# Altium project Pi Control Board V0.PrjPcb
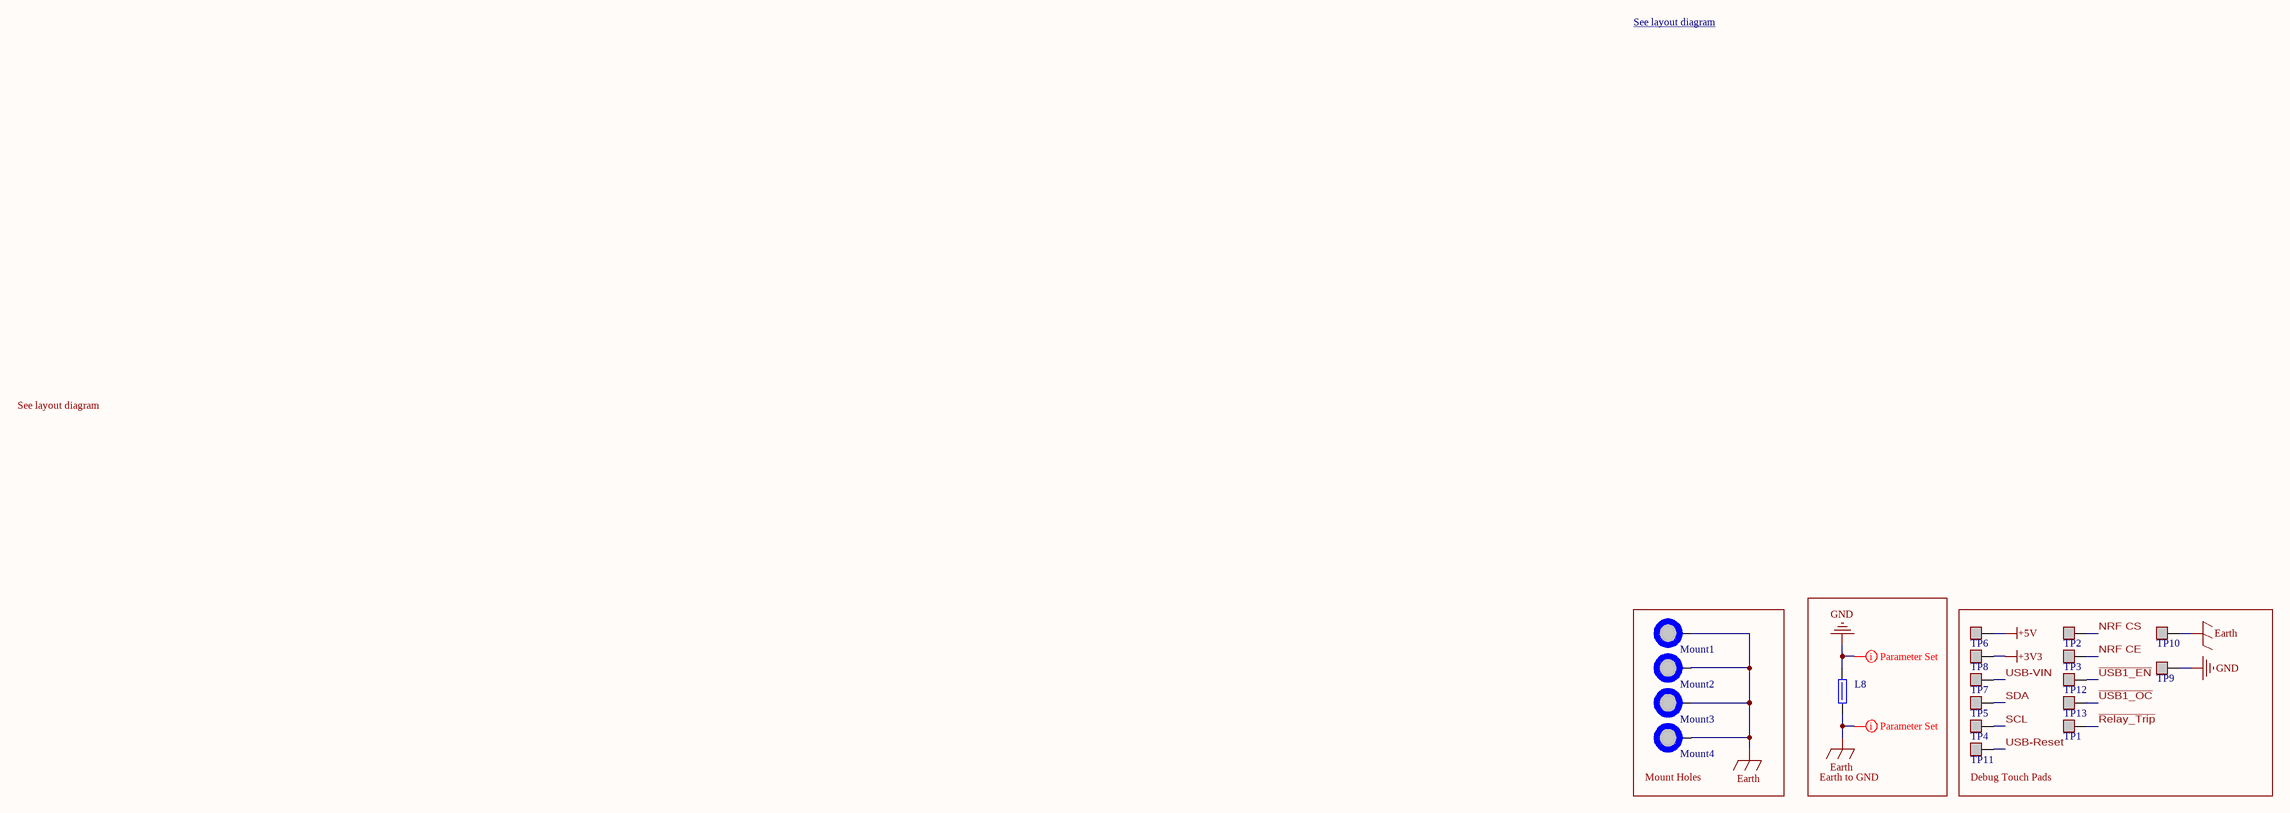
[diagram p0: Overview and Power.SchDoc]
9 sheets, 202 parts. Net scope: global (net labels, ports and power ports of the same name join across sheets).
Board file: main.PcbDoc
Sheets:
  Overview and Power.SchDoc
  Power.SchDoc
  RP2350.SchDoc
  NRF24L01P.SchDoc
  ESP32-S2.SchDoc
  USB Hub.SchDoc
  Safety Devices.SchDoc
  Motor Drivers.SchDoc
  Peripheral Connections.SchDoc

## Sheet Overview and Power.SchDoc
size A; SheetNumber: 1; SheetTotal: 9

### Parts
L8  742792040  [[Ferrite] SMD Bead 0805 (2)]  (value not drawn)
Mount1  M3 Mount Hole  [[Mount] M3 Mount Hole]  (value not drawn)  (no BOM)
Mount2  M3 Mount Hole  [[Mount] M3 Mount Hole]  (value not drawn)  (no BOM)
Mount3  M3 Mount Hole  [[Mount] M3 Mount Hole]  (value not drawn)  (no BOM)
Mount4  M3 Mount Hole  [[Mount] M3 Mount Hole]  (value not drawn)  (no BOM)
TP1  Probe Pad  [[Probe] Touch Pad]  (value not drawn)  (no BOM)
TP2  Probe Pad  [[Probe] Touch Pad]  (value not drawn)  (no BOM)
TP3  Probe Pad  [[Probe] Touch Pad]  (value not drawn)  (no BOM)
TP4  Probe Pad  [[Probe] Touch Pad]  (value not drawn)  (no BOM)
TP5  Probe Pad  [[Probe] Touch Pad]  (value not drawn)  (no BOM)
TP6  Probe Pad  [[Probe] Touch Pad]  (value not drawn)  (no BOM)
TP7  Probe Pad  [[Probe] Touch Pad]  (value not drawn)  (no BOM)
TP8  Probe Pad  [[Probe] Touch Pad]  (value not drawn)  (no BOM)
TP9  Probe Pad  [[Probe] Touch Pad]  (value not drawn)  (no BOM)
TP10  Probe Pad  [[Probe] Touch Pad]  (value not drawn)  (no BOM)
TP11  Probe Pad  [[Probe] Touch Pad]  (value not drawn)  (no BOM)
TP12  Probe Pad  [[Probe] Touch Pad]  (value not drawn)  (no BOM)
TP13  Probe Pad  [[Probe] Touch Pad]  (value not drawn)  (no BOM)

### Blocks framed on the sheet
Mount Holes: Mount1-Mount4
Earth to GND: L8
Debug Touch Pads: TP1-TP13

### Nets
+3V3: TP8.1
+5V: TP6.1
Earth: L8.1 Mount1.1 Mount2.1 Mount3.1 Mount4.1 TP10.1
GND: L8.2 TP9.1
~{Relay_Trip}: TP1.1
~{USB1_EN}: TP12.1
~{USB1_OC}: TP13.1
NRF CE: TP3.1
NRF CS: TP2.1
SCL: TP4.1
SDA: TP5.1
USB-Reset: TP11.1
USB-VIN: TP7.1

### Layout directives
net class Supply_Nets: Earth, GND

### Notes on the sheet
- See layout diagram <https://drive.google.com/file/d/1B1LZ2g49TOjqrB7c7O0v-CyvsEDjMjX-/view?usp=drive_link>
- See layout diagram

### Library data of the parts
L8 = [Ferrite] SMD Ferrite Bead (2): Supplier 1: DigiKey; Supplier Part Number 1: 732-1620-1-ND
Mount1-Mount4 = [Mount] M3 Mount Hole: Place at least 4.5mm from board edge. Plated.
TP1-TP13 = [Probe] Touch Pad

## Sheet Power.SchDoc
size A; SheetNumber: 2; SheetTotal: 9
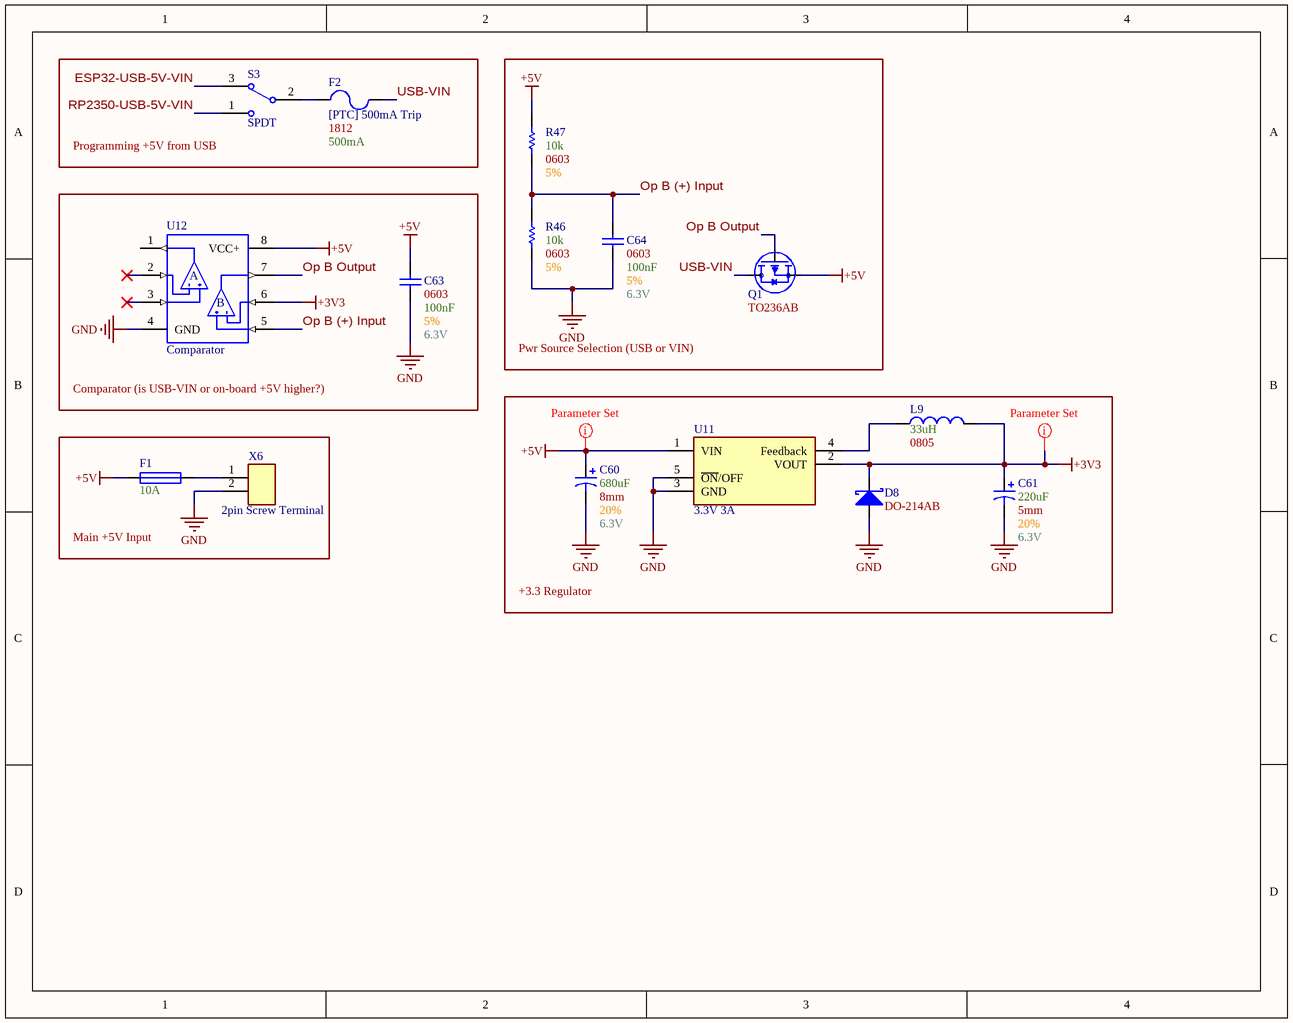
[diagram p1: Power.SchDoc]

### Parts
C60  Tolerance: 20%  Max Voltage: 6.3V  Capacitance: 680uF  Diameter: 8mm  [[Cap] SMD Polarized, 8mm]  (hidden comment: SMD Polarized)
C61  Tolerance: 20%  Max Voltage: 6.3V  Capacitance: 220uF  Diameter: 5mm  [[Cap] SMD Polarized, 5mm]  (hidden comment: SMD Polarized)
C63  Size Package: 0603  Capacitance: 100nF  Voltage: 6.3V  Tolerance: 5%  [[Cap] SMD 0603]  (hidden comment: [Cap] SMD Nonpolarized)
C64  Size Package: 0603  Capacitance: 100nF  Voltage: 6.3V  Tolerance: 5%  [[Cap] SMD 0603]  (hidden comment: [Cap] SMD Nonpolarized)
D8  Size Package: DO-214AB  [[Diode] SMD DO-214AB]  (hidden comment: Schottky)
F1  Amperage: 10A  [[Fuse] Blade Right-Angle]  (hidden comment: Right-Angle)
F2  [PTC] 500mA Trip  Size Package: 1812  Trip Current: 500mA  [[PTC] 500mA Trip]
L9  Size Package: 0805  Inductance: 33uH  [[Inductor] SMD 0805]  (hidden comment: SMD Inductor)
Q1  Size Package: TO236AB  [[FET] P-Channel Mosfet]  (hidden comment: PMV48XP)
R46  Resistance: 10k  Size Package: 0603  Tolerance: 5%  [[Res] SMD 0603]  (hidden comment: [Res] SMD Resistor)
R47  Resistance: 10k  Size Package: 0603  Tolerance: 5%  [[Res] SMD 0603]  (hidden comment: [Res] SMD Resistor)
S3  SPDT  [[Switch] SPDT]
U11  3.3V 3A  [[Reg] 3V3 Regulator (4)]
U12  Comparator  [[IC] Dual Op-Ap]
X6  2pin Screw Terminal  [[Screw Terminal] 2pin 5mm]

### Blocks framed on the sheet
Programming +5V from USB: F2 S3
Pwr Source Selection (USB or VIN): C64 Q1 R46 R47
Comparator (is USB-VIN or on-board +5V higher?): C63 U12
+3.3 Regulator: C60 C61 D8 L9 U11
Main +5V Input: F1 X6

### Nets
+3V3: C61.1 D8.1(K) L9.2 U11.2(VOUT) U12.6(2IN-)
+5V: C60.1 C63.2 F1.1 Q1.2(S) R47.2 U11.1(VIN) U12.8(VCC+)
GND: C60.2 C61.2 C63.1 C64.1 D8.2(A) R46.1 U11.3(GND) U11.5(~{ON}/OFF) U12.4(GND) X6.2
ESP32-USB-5V-VIN: S3.3
Op B (+) Input: C64.2 R46.2 R47.1 U12.5(2IN+)
Op B Output: Q1.1(G) U12.7(2OUT)
RP2350-USB-5V-VIN: S3.1
USB-VIN: F2.2 Q1.3(D)
NetF1_2: F1.2 X6.1
NetF2_1: F2.1 S3.2
NetL9_1: L9.1 U11.4(Feedback)

Not connected (* = marked no-connect by the designer): U12 1(1OUT) 2(1IN-)* 3(1IN+)*

### Layout directives
net class Supply_Nets: +3V3, +5V

### Notes on the sheet
- (in symbol [IC] Dual Op-Amp) A; B

### Library data of the parts
C60 C61 = [Cap] SMD Polarized: Supplier 1: DigiKey
  C60: Supplier Part Number 1: PCE3781CT-ND
  C61: Supplier Part Number 1: 493-17593-1-ND
D8 = [Diode] SMD Schottky: Generic; Supplier 1: DigiKey; Supplier Part Number 1: B530C-FDICT-ND
F1 = [Fuse] Blade Right-Angle: Supplier 1: DigiKey; Supplier Part Number 1: 36-3549-2-ND
F2 = [PTC] 500mA Trip: MF-MSMF050-2; Supplier 1: DigiKey; Supplier Part Number 1: MF-MSMF050-2DKR-ND
L9 = [Inductor] SMD Inductor: JLC Part #: *; Mouser Part #: *; Supplier 1: DigiKey; Supplier Part Number 1: 445-6399-1-ND
Q1 = [FET] P-Channel MOSFET: Supplier 1: DigiKey; Supplier Part Number 1: 1727-PMV48XPA2RCT-ND
R46 R47 = [Res] SMD Resistor: Generic; Supplier 1: DigiKey; Supplier Part Number 1: 311-10.0KHRDKR-ND
S3 = [Switch] SPDT Switch: Supplier 1: DigiKey; Supplier Part Number 1: 1948-1087-ND
U11 = [Reg] 3V3 Regulator (4): 3A; Supplier 1: DigiKey; Supplier Part Number 1: LM2596SX-3.3/NOPBCT-ND
U12 = [IC] Dual Op-Amp: LMV358IDGKR; Supplier 1: DigiKey; Supplier Part Number 1: 296-13455-1-ND
X6 = [Screw Terminal] 2pin: Supplier 1: DigiKey; Supplier Part Number 1: 102-6145-ND
C63 C64 = [Cap] SMD Nonpolarized: Supplier 1: DigiKey; Supplier Part Number 1: 311-1088-6-ND

## Sheet RP2350.SchDoc
size B; SheetNumber: 3; SheetTotal: 9
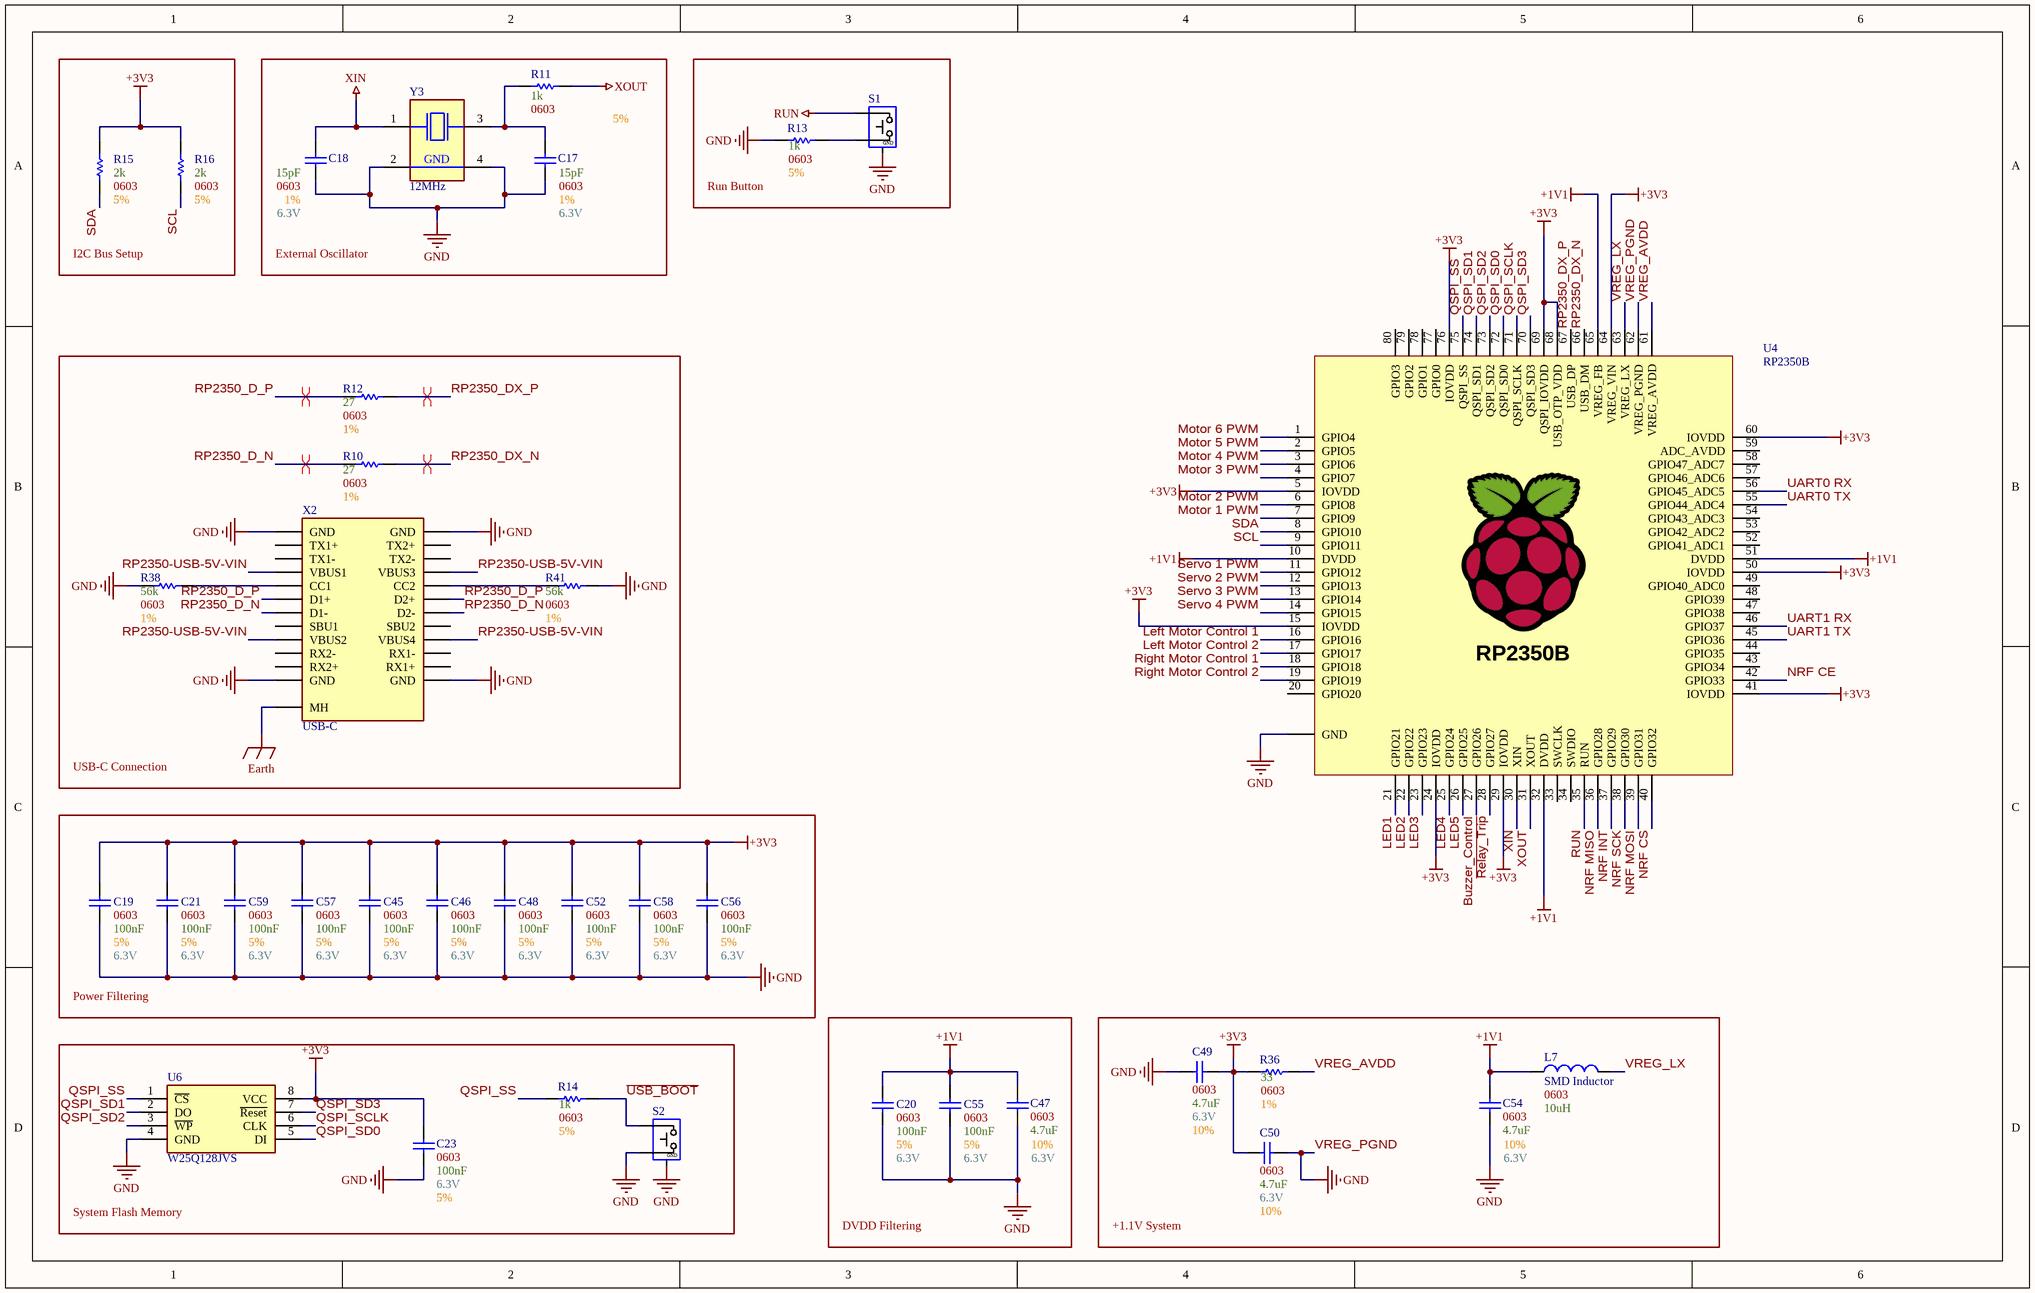
[diagram p2: RP2350.SchDoc]

### Parts
C17  Size Package: 0603  Capacitance: 15pF  Voltage: 6.3V  Tolerance: 1%  [[Cap] SMD 0603]  (hidden comment: [Cap] SMD Nonpolarized)
C18  Size Package: 0603  Capacitance: 15pF  Voltage: 6.3V  Tolerance: 1%  [[Cap] SMD 0603]  (hidden comment: [Cap] SMD Nonpolarized)
C19  Size Package: 0603  Capacitance: 100nF  Voltage: 6.3V  Tolerance: 5%  [[Cap] SMD 0603]  (hidden comment: [Cap] SMD Nonpolarized)
C20  Size Package: 0603  Capacitance: 100nF  Voltage: 6.3V  Tolerance: 5%  [[Cap] SMD 0603]  (hidden comment: [Cap] SMD Nonpolarized)
C21  Size Package: 0603  Capacitance: 100nF  Voltage: 6.3V  Tolerance: 5%  [[Cap] SMD 0603]  (hidden comment: [Cap] SMD Nonpolarized)
C23  Size Package: 0603  Capacitance: 100nF  Voltage: 6.3V  Tolerance: 5%  [[Cap] SMD 0603]  (hidden comment: [Cap] SMD Nonpolarized)
C45  Size Package: 0603  Capacitance: 100nF  Voltage: 6.3V  Tolerance: 5%  [[Cap] SMD 0603]  (hidden comment: [Cap] SMD Nonpolarized)
C46  Size Package: 0603  Capacitance: 100nF  Voltage: 6.3V  Tolerance: 5%  [[Cap] SMD 0603]  (hidden comment: [Cap] SMD Nonpolarized)
C47  Size Package: 0603  Capacitance: 4.7uF  Voltage: 6.3V  Tolerance: 10%  [[Cap] SMD 0603]  (hidden comment: [Cap] SMD Nonpolarized)
C48  Size Package: 0603  Capacitance: 100nF  Voltage: 6.3V  Tolerance: 5%  [[Cap] SMD 0603]  (hidden comment: [Cap] SMD Nonpolarized)
C49  Size Package: 0603  Capacitance: 4.7uF  Voltage: 6.3V  Tolerance: 10%  [[Cap] SMD 0603]  (hidden comment: [Cap] SMD Nonpolarized)
C50  Size Package: 0603  Capacitance: 4.7uF  Voltage: 6.3V  Tolerance: 10%  [[Cap] SMD 0603]  (hidden comment: [Cap] SMD Nonpolarized)
C52  Size Package: 0603  Capacitance: 100nF  Voltage: 6.3V  Tolerance: 5%  [[Cap] SMD 0603]  (hidden comment: [Cap] SMD Nonpolarized)
C54  Size Package: 0603  Capacitance: 4.7uF  Voltage: 6.3V  Tolerance: 10%  [[Cap] SMD 0603]  (hidden comment: [Cap] SMD Nonpolarized)
C55  Size Package: 0603  Capacitance: 100nF  Voltage: 6.3V  Tolerance: 5%  [[Cap] SMD 0603]  (hidden comment: [Cap] SMD Nonpolarized)
C56  Size Package: 0603  Capacitance: 100nF  Voltage: 6.3V  Tolerance: 5%  [[Cap] SMD 0603]  (hidden comment: [Cap] SMD Nonpolarized)
C57  Size Package: 0603  Capacitance: 100nF  Voltage: 6.3V  Tolerance: 5%  [[Cap] SMD 0603]  (hidden comment: [Cap] SMD Nonpolarized)
C58  Size Package: 0603  Capacitance: 100nF  Voltage: 6.3V  Tolerance: 5%  [[Cap] SMD 0603]  (hidden comment: [Cap] SMD Nonpolarized)
C59  Size Package: 0603  Capacitance: 100nF  Voltage: 6.3V  Tolerance: 5%  [[Cap] SMD 0603]  (hidden comment: [Cap] SMD Nonpolarized)
L7  SMD Inductor  Size Package: 0603  Inductance: 10uH  [[Inductor] SMD 0603]
R10  Tolerance: 1%  Resistance: 27  Size Package: 0603  [[Res] SMD 0603]  (hidden comment: [Res] SMD Resistor)
R11  Resistance: 1k  Size Package: 0603  Tolerance: 5%  [[Res] SMD 0603]  (hidden comment: [Res] SMD Resistor)
R12  Tolerance: 1%  Resistance: 27  Size Package: 0603  [[Res] SMD 0603]  (hidden comment: [Res] SMD Resistor)
R13  Resistance: 1k  Size Package: 0603  Tolerance: 5%  [[Res] SMD 0603]  (hidden comment: [Res] SMD Resistor)
R14  Resistance: 1k  Size Package: 0603  Tolerance: 5%  [[Res] SMD 0603]  (hidden comment: [Res] SMD Resistor)
R15  Resistance: 2k  Size Package: 0603  Tolerance: 5%  [[Res] SMD 0603]  (hidden comment: [Res] SMD Resistor)
R16  Resistance: 2k  Size Package: 0603  Tolerance: 5%  [[Res] SMD 0603]  (hidden comment: [Res] SMD Resistor)
R36  Resistance: 33  Size Package: 0603  Tolerance: 1%  [[Res] SMD 0603]  (hidden comment: [Res] SMD Resistor)
R38  Tolerance: 1%  Resistance: 56k  Size Package: 0603  [[Res] SMD 0603]  (hidden comment: [Res] SMD Resistor)
R41  Tolerance: 1%  Resistance: 56k  Size Package: 0603  [[Res] SMD 0603]  (hidden comment: [Res] SMD Resistor)
S1  [Switch] Pushbutton SMD  [[Switch] Pushbutton SMD 2]  (value not drawn)
S2  [Switch] Pushbutton SMD  [[Switch] Pushbutton SMD 2]  (value not drawn)
U4  RP2350B  [[MCU] RP2350B]
U6  W25Q128JVS  [[Mem] 16Mb Flash Memory]
X2  USB-C  [[Port] USB-C]
Y3  12MHz  [[XTAL] SMD 12MHz]

### Blocks framed on the sheet
I2C Bus Setup: R15 R16
External Oscillator: C17 C18 R11 Y3
Run Button: R13 S1
USB-C Connection: R10 R12 R38 R41 X2
Power Filtering: C19 C21 C45 C46 C48 C52 C56-C59
DVDD Filtering: C20 C47 C55
+1.1V System: C49 C50 C54 L7 R36
System Flash Memory: C23 R14 S2 U6

### Nets
+1V1: C20.2 C47.2 C54.2 C55.2 L7.1 U4.10(DVDD) U4.32(DVDD) U4.51(DVDD) U4.65(VREG_FB)
+3V3: C19.2 C21.2 C23.1 C45.2 C46.2 C48.2 C49.1 C50.2 C52.2 C56.2 C57.2 C58.2 C59.2 R15.2 R16.2 R36.2 U4.5(IOVDD) U4.15(IOVDD) U4.24(IOVDD) U4.29(IOVDD) U4.41(IOVDD) U4.50(IOVDD) U4.60(IOVDD) U4.64(VREG_VIN) U4.68(USB_OTP_VDD) U4.69(QSPI_IOVDD) U4.76(IOVDD) U6.8(VCC)
Earth: X2.MH
GND: C17.1 C18.1 C19.1 C20.1 C21.1 C23.2 C45.1 C46.1 C47.1 C48.1 C49.2 C50.1 C52.1 C54.1 C55.1 C56.1 C57.1 C58.1 C59.1 R13.2 R38.1 R41.2 S1.GND S2.2 S2.GND U4.62(VREG_PGND) U4.Pad(GND) U6.4(GND) X2.A1(GND) X2.A12(GND) X2.B1(GND) X2.B12(GND) Y3.2(GND) Y3.4(GND)  [also labelled VREG_PGND]
RUN: S1.1 U4.35(RUN)
XIN: C18.2 U4.30(XIN) Y3.1(XTAL1)
XOUT: R11.1 U4.31(XOUT)
~{Relay_Trip}: U4.28(GPIO27)
Buzzer_Control: U4.27(GPIO26)
LED1: U4.21(GPIO21)
LED2: U4.22(GPIO22)
LED3: U4.23(GPIO23)
LED4: U4.25(GPIO24)
LED5: U4.26(GPIO25)
Left Motor Control 1: U4.16(GPIO16)
Left Motor Control 2: U4.17(GPIO17)
Motor 1 PWM: U4.7(GPIO9)
Motor 2 PWM: U4.6(GPIO8)
Motor 3 PWM: U4.4(GPIO7)
Motor 4 PWM: U4.3(GPIO6)
Motor 5 PWM: U4.2(GPIO5)
Motor 6 PWM: U4.1(GPIO4)
NRF CE: U4.42(GPIO33)
NRF CS: U4.40(GPIO32)
NRF INT: U4.37(GPIO29)
NRF MISO: U4.36(GPIO28)
NRF MOSI: U4.39(GPIO31)
NRF SCK: U4.38(GPIO30)
QSPI_SCLK: U4.71(QSPI_SCLK) U6.6(CLK)
QSPI_SD0: U4.72(QSPI_SD0) U6.5(DI)
QSPI_SD1: U4.74(QSPI_SD1) U6.2(DO)
QSPI_SD2: U4.73(QSPI_SD2) U6.3(~{WP})
QSPI_SD3: U4.70(QSPI_SD3) U6.7(~{Reset})
QSPI_SS: R14.2 U4.75(QSPI_SS) U6.1(~{CS})
Right Motor Control 1: U4.18(GPIO18)
Right Motor Control 2: U4.19(GPIO19)
RP2350-USB-5V-VIN: X2.A4(VBUS1) X2.A9(VBUS2) X2.B4(VBUS3) X2.B9(VBUS4)
RP2350_D_N: R10.1 X2.A7(D1-) X2.B7(D2-)
RP2350_D_P: R12.1 X2.A6(D1+) X2.B6(D2+)
RP2350_DX_N: R10.2 U4.66(USB_DM)
RP2350_DX_P: R12.2 U4.67(USB_DP)
SCL: R16.1 U4.9(GPIO11)
SDA: R15.1 U4.8(GPIO10)
Servo 1 PWM: U4.11(GPIO12)
Servo 2 PWM: U4.12(GPIO13)
Servo 3 PWM: U4.13(GPIO14)
Servo 4 PWM: U4.14(GPIO15)
~{USB_BOOT}: R14.1 S2.1
UART0 RX: U4.56(GPIO45_ADC5)
UART0 TX: U4.55(GPIO44_ADC4)
UART1 RX: U4.46(GPIO37)
UART1 TX: U4.45(GPIO36)
VREG_AVDD: R36.1 U4.61(VREG_AVDD)
VREG_LX: L7.2 U4.63(VREG_LX)
NetC17_2: C17.2 R11.2 Y3.3(XTAL2)
NetR13_1: R13.1 S1.2
NetR38_2: R38.2 X2.A5(CC1)
NetR41_1: R41.1 X2.B5(CC2)

Not connected (* = marked no-connect by the designer): U4 20(GPIO20) 33(SWCLK) 34(SWDIO) 43(GPIO34) 44(GPIO35) 47(GPIO38) 48(GPIO39) 49(GPIO40_ADC0) 52(GPIO41_ADC1) 53(GPIO42_ADC2) 54(GPIO43_ADC3) 57(GPIO46_ADC6) 58(GPIO47_ADC7) 59(ADC_AVDD) 77(GPIO0) 78(GPIO1) 79(GPIO2) 80(GPIO3); X2 A2(TX1+) A3(TX1-) A8(SBU1) A10(RX2-) A11(RX2+) B2(TX2+) B3(TX2-) B8(SBU2) B10(RX1-) B11(RX1+)

### Layout directives
differential pair; differential pair class USB_Pairs: RP2350_D_N, RP2350_D_P, RP2350_DX_N, RP2350_DX_P

### Library data of the parts
L7 = [Inductor] SMD Inductor: JLC Part #: *; Mouser Part #: *; Supplier 1: DigiKey; Supplier Part Number 1: 445-6755-1-ND
R10-R16 R36 R38 R41 = [Res] SMD Resistor: Generic; Supplier 1: DigiKey
  R10 R12: Supplier Part Number 1: 749-1631-1-ND
  R11 R13 R14: Supplier Part Number 1: RMCF0603FT1K00DKR-ND
  R15 R16: Supplier Part Number 1: P2.0KBDCT-ND
  R36: Supplier Part Number 1: RR08Q33DCT-ND
  R38 R41: Supplier Part Number 1: A129709CT-ND
U4 = [MCU] RP2350B: QFN-80 Package; Supplier 1: DigiKey; Supplier Part Number 1: 2648-SC1510-A4CT-ND
U6 = [Mem] 16Mb Flash Memory: W25Q128JVSIQ TR; Supplier 1: DigiKey; Supplier Part Number 1: 256-W25Q128JVSIQTRCT-ND
X2 = [Port] USB Type-C: Supplier 1: DigiKey; Supplier Part Number 1: 670-3104-1-ND
Y3 = [XTAL] SMD 12MHz: 815-ABM8-272-T3; Supplier 1: DigiKey; Supplier Part Number 1: 535-ABM8-272-T3CT-ND
C17-C21 C23 C45-C50 C52 C54-C59 = [Cap] SMD Nonpolarized: Supplier 1: DigiKey
  C17 C18: Supplier Part Number 1: 490-16416-1-ND
  C19-C21 C23 C45 C46 C48 C52 C55-C59: Supplier Part Number 1: 311-1088-6-ND
  C47 C49 C50 C54: Supplier Part Number 1: 490-7203-1-ND
S1 S2 = [Switch] Pushbutton SMD: Supplier 1: DigiKey; Supplier Part Number 1: SW1021CT-ND

## Sheet NRF24L01P.SchDoc
size A; SheetNumber: 4; SheetTotal: 9
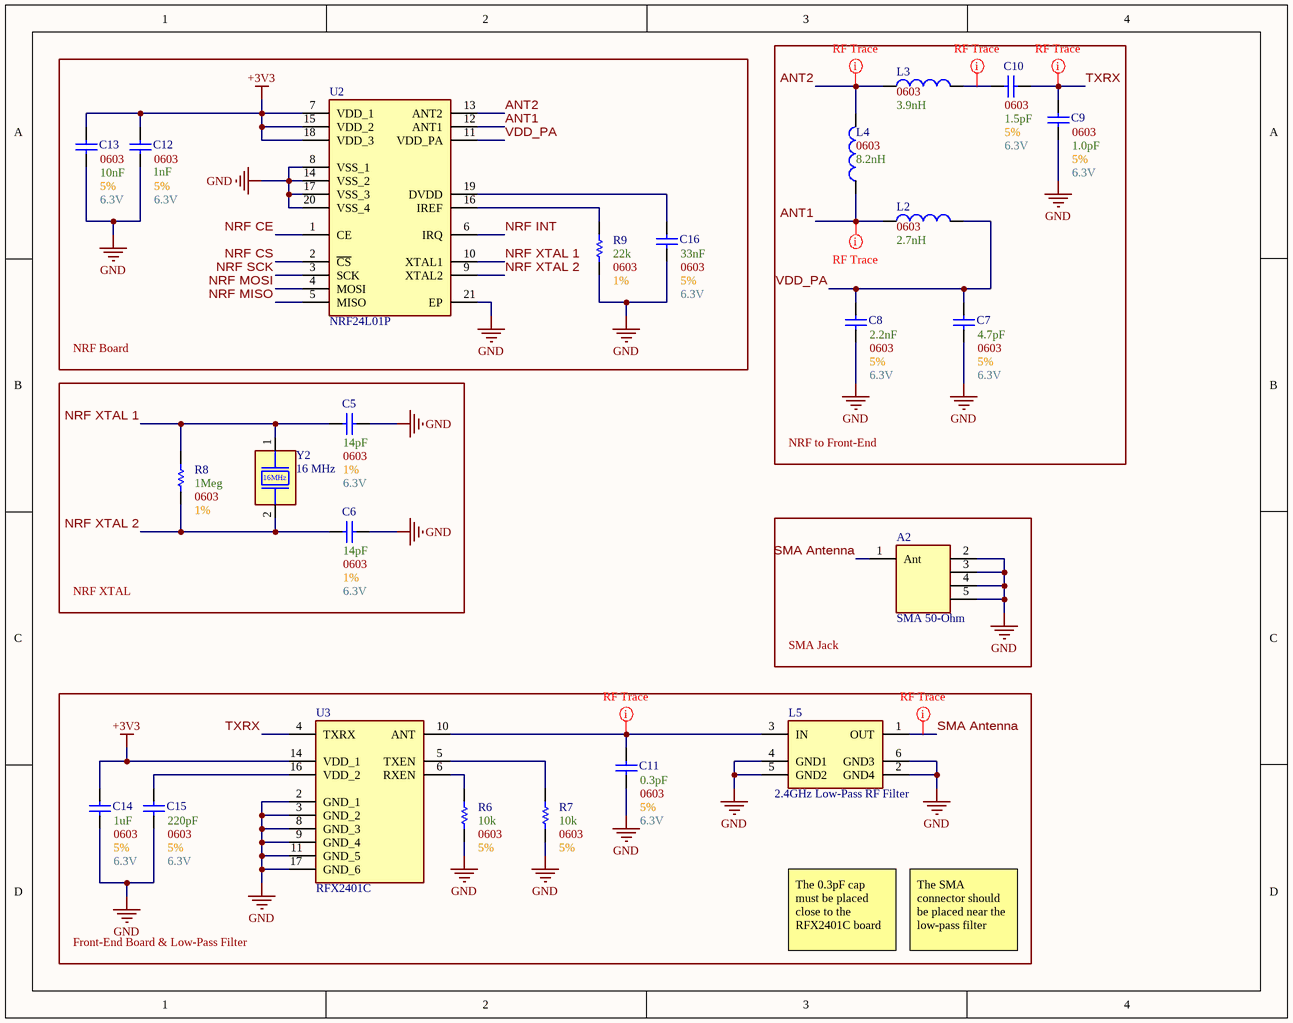
[diagram p3: NRF24L01P.SchDoc]

### Parts
A2  SMA 50-Ohm  [[SMA] 90deg Jack]
C5  Tolerance: 1%  Size Package: 0603  Capacitance: 14pF  Voltage: 6.3V  [[Cap] SMD 0603]  (hidden comment: SMD Nonpolarized)
C6  Tolerance: 1%  Size Package: 0603  Capacitance: 14pF  Voltage: 6.3V  [[Cap] SMD 0603]  (hidden comment: SMD Nonpolarized)
C7  Tolerance: 5%  Size Package: 0603  Capacitance: 4.7pF  Voltage: 6.3V  [[Cap] SMD 0603]  (hidden comment: SMD Nonpolarized)
C8  Tolerance: 5%  Size Package: 0603  Capacitance: 2.2nF  Voltage: 6.3V  [[Cap] SMD 0603]  (hidden comment: SMD Nonpolarized)
C9  Tolerance: 5%  Size Package: 0603  Capacitance: 1.0pF  Voltage: 6.3V  [[Cap] SMD 0603]  (hidden comment: SMD Nonpolarized)
C10  Tolerance: 5%  Size Package: 0603  Capacitance: 1.5pF  Voltage: 6.3V  [[Cap] SMD 0603]  (hidden comment: SMD Nonpolarized)
C11  Tolerance: 5%  Size Package: 0603  Capacitance: 0.3pF  Voltage: 6.3V  [[Cap] SMD 0603]  (hidden comment: SMD Nonpolarized)
C12  Tolerance: 5%  Size Package: 0603  Capacitance: 1nF  Voltage: 6.3V  [[Cap] SMD 0603]  (hidden comment: SMD Nonpolarized)
C13  Tolerance: 5%  Size Package: 0603  Capacitance: 10nF  Voltage: 6.3V  [[Cap] SMD 0603]  (hidden comment: SMD Nonpolarized)
C14  Tolerance: 5%  Size Package: 0603  Capacitance: 1uF  Voltage: 6.3V  [[Cap] SMD 0603]  (hidden comment: SMD Nonpolarized)
C15  Tolerance: 5%  Size Package: 0603  Capacitance: 220pF  Voltage: 6.3V  [[Cap] SMD 0603]  (hidden comment: SMD Nonpolarized)
C16  Tolerance: 5%  Size Package: 0603  Capacitance: 33nF  Voltage: 6.3V  [[Cap] SMD 0603]  (hidden comment: SMD Nonpolarized)
L2  Size Package: 0603  Inductance: 2.7nH  [[Inductor] SMD 0603]  (hidden comment: SMD Inductor)
L3  Size Package: 0603  Inductance: 3.9nH  [[Inductor] SMD 0603]  (hidden comment: SMD Inductor)
L4  Size Package: 0603  Inductance: 8.2nH  [[Inductor] SMD 0603]  (hidden comment: SMD Inductor)
L5  2.4GHz Low-Pass RF Filter  [[Inductor] 2.4GHz Low-Pass RF Filter]
R6  Tolerance: 5%  Resistance: 10k  Size Package: 0603  [[Res] SMD 0603]  (hidden comment: [Res] SMD Resistor)
R7  Tolerance: 5%  Resistance: 10k  Size Package: 0603  [[Res] SMD 0603]  (hidden comment: [Res] SMD Resistor)
R8  Tolerance: 1%  Resistance: 1Meg  Size Package: 0603  [[Res] SMD 0603]  (hidden comment: [Res] SMD Resistor)
R9  Tolerance: 1%  Resistance: 22k  Size Package: 0603  [[Res] SMD 0603]  (hidden comment: [Res] SMD Resistor)
U2  NRF24L01P  [[IC] NRF Transceiver]
U3  RFX2401C  [[IC] RF Front-End]
Y2  16 MHz  [[XTAL] SMD 16MHz (2)]

### Blocks framed on the sheet
NRF Board: C12 C13 C16 R9 U2
NRF to Front-End: C7-C10 L2-L4
NRF XTAL: C5 C6 R8 Y2
SMA Jack: A2
Front-End Board & Low-Pass Filter: C11 C14 C15 L5 R6 R7 U3

### Nets
+3V3: C12.2 C13.2 C14.2 U2.7(VDD_1) U2.15(VDD_2) U2.18(VDD_3) U3.14(VDD_1)
GND: A2.2 A2.3 A2.4 A2.5 C5.2 C6.2 C7.1 C8.1 C9.2 C11.1 C12.1 C13.1 C14.1 C15.1 C16.1 L5.2(GND4) L5.4(GND1) L5.5(GND2) L5.6(GND3) R6.1 R7.1 R9.1 U2.8(VSS_1) U2.14(VSS_2) U2.17(VSS_3) U2.20(VSS_4) U2.21(EP) U3.2(GND_1) U3.3(GND_2) U3.8(GND_3) U3.9(GND_4) U3.11(GND_5) U3.17(GND_6)
ANT1: L2.1 L4.1 U2.12(ANT1)
ANT2: L3.1 L4.2 U2.13(ANT2)
NRF CE: U2.1(CE)
NRF CS: U2.2(~{CS})
NRF INT: U2.6(IRQ)
NRF MISO: U2.5(MISO)
NRF MOSI: U2.4(MOSI)
NRF SCK: U2.3(SCK)
NRF XTAL 1: C5.1 R8.2 U2.10(XTAL1) Y2.1(XTAL1)
NRF XTAL 2: C6.1 R8.1 U2.9(XTAL2) Y2.2(XTAL2)
SMA Antenna: A2.1(Ant) L5.1(OUT)
TXRX: C9.1 C10.1 U3.4(TXRX)
VDD_PA: C7.2 C8.2 L2.2 U2.11(VDD_PA)
NetC10_2: C10.2 L3.2
NetC11_2: C11.2 L5.3(IN) U3.10(ANT)
NetC15_2: C15.2 U3.16(VDD_2)
NetC16_2: C16.2 U2.19(DVDD)
NetR6_2: R6.2 U3.6(RXEN)
NetR7_2: R7.2 U3.5(TXEN)
NetR9_2: R9.2 U2.16(IREF)

### Layout directives
net class nRF Signal: ANT1, ANT2, NetC10_2, NetC11_2, SMA Antenna, TXRX

### Notes on the sheet
- The 0.3pF cap must be placed close to the RFX2401C board
- The SMA connector should be placed near the low-pass filter
- (in symbol [XTAL] SMD 16MHz (2)) 16MHz

### Library data of the parts
A2 = [SMA] 90deg Jack: SMA-J-P-H-RA-TH1; Supplier 1: DigiKey; Supplier Part Number 1: SAM8856-ND
C5-C16 = [Cap] SMD Nonpolarized: Supplier 1: DigiKey
  C5 C6: Supplier Part Number 1: 311-3887-1-ND
  C7: Supplier Part Number 1: 13-CC0603CPNPO9BN4R7CT-ND
  C8: Supplier Part Number 1: 490-1459-1-ND
  C9: Supplier Part Number 1: 311-1049-1-ND
  C10: Supplier Part Number 1: 311-1737-1-ND
  C11: Supplier Part Number 1: 712-QSCP251Q0R3A1GV001TCT-ND
  C12: Supplier Part Number 1: 490-1451-6-ND
  C13: Supplier Part Number 1: 399-C0603C103J5RACTUDKR-ND
  C14: Supplier Part Number 1: 311-3485-1-ND
  C15: Supplier Part Number 1: 399-C0603C221J5GAC7411CT-ND
  C16: Supplier Part Number 1: 311-4015-1-ND
L2-L4 = [Inductor] SMD Inductor: JLC Part #: *; Mouser Part #: *; Supplier 1: DigiKey
  L2: Supplier Part Number 1: 490-1103-1-ND
  L3: Supplier Part Number 1: 490-1105-1-ND
  L4: Supplier Part Number 1: 490-1109-1-ND
L5 = [Inductor] 2.4GHz Low-Pass RF Filter: MLPF-NRG-01D3; Supplier 1: DigiKey; Supplier Part Number 1: 497-MLPF-NRG-01D3CT-ND
R6-R9 = [Res] SMD Resistor: Generic; Supplier 1: DigiKey
  R6 R7: Supplier Part Number 1: 311-10.0KHRDKR-ND
  R8: Supplier Part Number 1: 311-1.00MHRDKR-ND
  R9: Supplier Part Number 1: 311-22.0HRDKR-ND
U2 = [IC] NRF Transceiver: NRF24L01P-R; Supplier 1: DigiKey; Supplier Part Number 1: 4823-NRF24L01P-RCT-ND
U3 = [IC] RF Front-End: Supplier 1: DigiKey; Supplier Part Number 1: 863-1828-1-ND
Y2 = [XTAL] SMD 16MHz (2): ABM11-16.000MHZ-12-N1G-T; Supplier 1: DigiKey; Supplier Part Number 1: 535-14950-1-ND

## Sheet ESP32-S2.SchDoc
size B; SheetNumber: 5; SheetTotal: 9
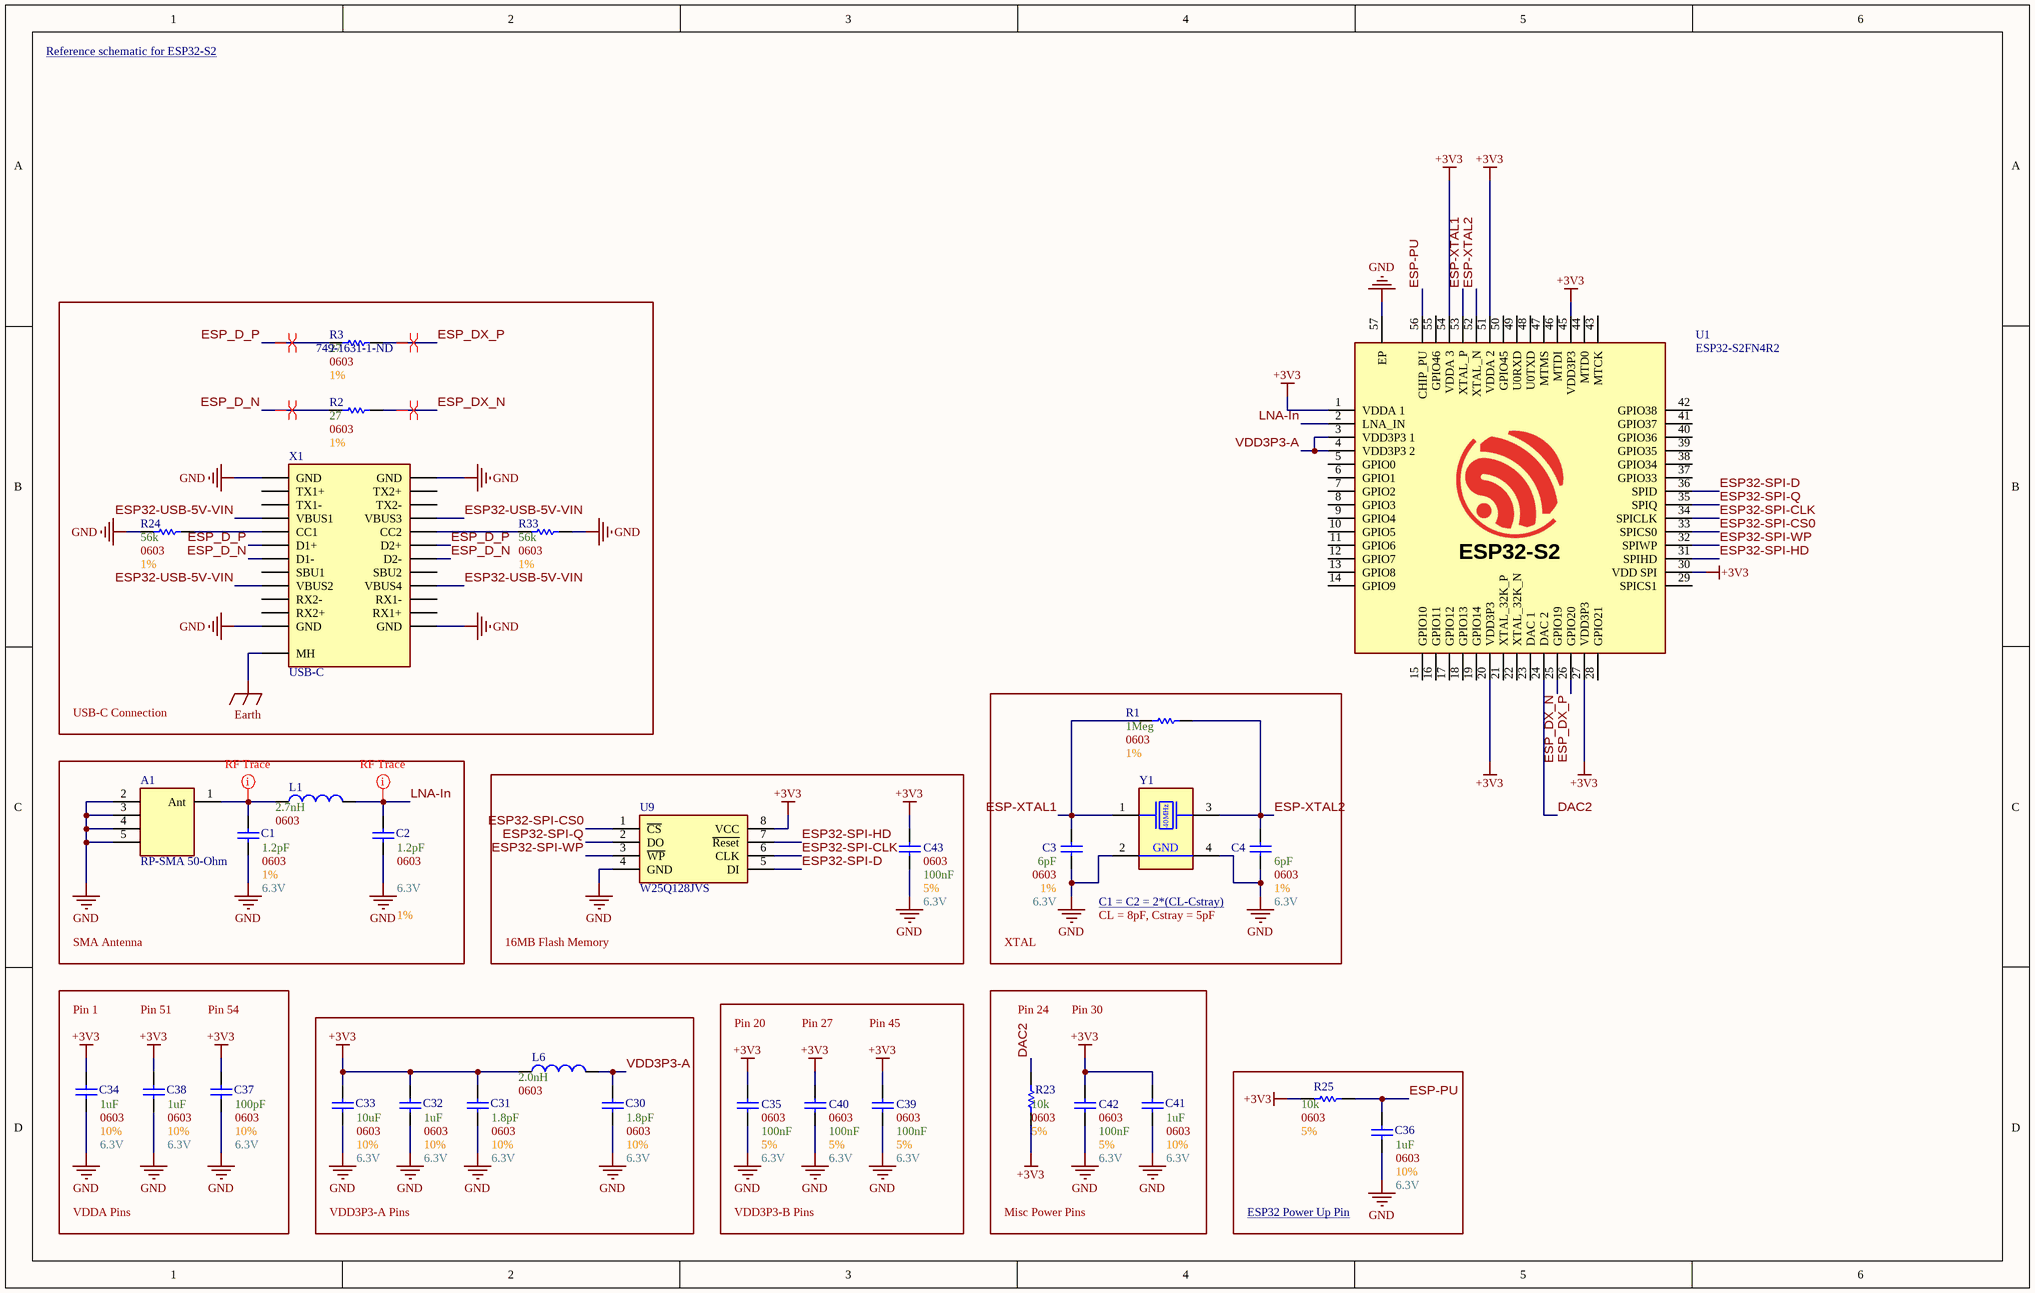
[diagram p4: ESP32-S2.SchDoc]

### Parts
(Parts that share a designator on the sheet are numbered #1, #2 ... from top to bottom, then left to right.)
A1  RP-SMA 50-Ohm  [[SMA] RP-SMA 90deg Jack]
C1  Voltage: 6.3V  Tolerance: 1%  Size Package: 0603  Capacitance: 1.2pF  [[Cap] SMD 0603]  (hidden comment: SMD Nonpolarized)
C2  Voltage: 6.3V  Tolerance: 1%  Size Package: 0603  Capacitance: 1.2pF  [[Cap] SMD 0603]  (hidden comment: SMD Nonpolarized)
C3  Voltage: 6.3V  Tolerance: 1%  Size Package: 0603  Capacitance: 6pF  [[Cap] SMD 0603]  (hidden comment: SMD Nonpolarized)
C4  Voltage: 6.3V  Tolerance: 1%  Size Package: 0603  Capacitance: 6pF  [[Cap] SMD 0603]  (hidden comment: SMD Nonpolarized)
C30  Voltage: 6.3V  Tolerance: 10%  Size Package: 0603  Capacitance: 1.8pF  [[Cap] SMD 0603]  (hidden comment: SMD Nonpolarized)
C31  Voltage: 6.3V  Tolerance: 10%  Size Package: 0603  Capacitance: 1.8pF  [[Cap] SMD 0603]  (hidden comment: SMD Nonpolarized)
C32  Voltage: 6.3V  Tolerance: 10%  Size Package: 0603  Capacitance: 1uF  [[Cap] SMD 0603]  (hidden comment: SMD Nonpolarized)
C33  Voltage: 6.3V  Tolerance: 10%  Size Package: 0603  Capacitance: 10uF  [[Cap] SMD 0603]  (hidden comment: SMD Nonpolarized)
C34  Voltage: 6.3V  Tolerance: 10%  Size Package: 0603  Capacitance: 1uF  [[Cap] SMD 0603]  (hidden comment: SMD Nonpolarized)
C35  Size Package: 0603  Capacitance: 100nF  Voltage: 6.3V  Tolerance: 5%  [[Cap] SMD 0603]  (hidden comment: [Cap] SMD Nonpolarized)
C36  Voltage: 6.3V  Tolerance: 10%  Size Package: 0603  Capacitance: 1uF  [[Cap] SMD 0603]  (hidden comment: SMD Nonpolarized)
C37  Voltage: 6.3V  Tolerance: 10%  Size Package: 0603  Capacitance: 100pF  [[Cap] SMD 0603]  (hidden comment: SMD Nonpolarized)
C38  Voltage: 6.3V  Tolerance: 10%  Size Package: 0603  Capacitance: 1uF  [[Cap] SMD 0603]  (hidden comment: SMD Nonpolarized)
C39  Size Package: 0603  Capacitance: 100nF  Voltage: 6.3V  Tolerance: 5%  [[Cap] SMD 0603]  (hidden comment: [Cap] SMD Nonpolarized)
C40  Size Package: 0603  Capacitance: 100nF  Voltage: 6.3V  Tolerance: 5%  [[Cap] SMD 0603]  (hidden comment: [Cap] SMD Nonpolarized)
C41  Voltage: 6.3V  Tolerance: 10%  Size Package: 0603  Capacitance: 1uF  [[Cap] SMD 0603]  (hidden comment: SMD Nonpolarized)
C42  Size Package: 0603  Capacitance: 100nF  Voltage: 6.3V  Tolerance: 5%  [[Cap] SMD 0603]  (hidden comment: [Cap] SMD Nonpolarized)
C43  Size Package: 0603  Capacitance: 100nF  Voltage: 6.3V  Tolerance: 5%  [[Cap] SMD 0603]  (hidden comment: [Cap] SMD Nonpolarized)
L1  Size Package: 0603  Inductance: 2.7nH  [[Inductor] SMD 0603]  (hidden comment: SMD Inductor)
L6  Size Package: 0603  Inductance: 2.0nH  [[Inductor] SMD 0603]  (hidden comment: SMD Inductor)
R1  Tolerance: 1%  Resistance: 1Meg  Size Package: 0603  [[Res] SMD 0603]  (hidden comment: [Res] SMD Resistor)
R2  Tolerance: 1%  Resistance: 27  Size Package: 0603  [[Res] SMD 0603]  (hidden comment: [Res] SMD Resistor)
R3  Tolerance: 1%  Resistance: 27  Size Package: 0603  Supplier Part Number 1: 749-1631-1-ND  [[Res] SMD 0603]  (hidden comment: [Res] SMD Resistor)
R23#1  Tolerance: 5%  Resistance: 10k  Size Package: 0603  [[Res] SMD 0603]  (hidden comment: [Res] SMD Resistor)
R24#1  Tolerance: 1%  Resistance: 56k  Size Package: 0603  [[Res] SMD 0603]  (hidden comment: [Res] SMD Resistor)
R25#1  Tolerance: 5%  Resistance: 10k  Size Package: 0603  [[Res] SMD 0603]  (hidden comment: [Res] SMD Resistor)
R33  Tolerance: 1%  Resistance: 56k  Size Package: 0603  [[Res] SMD 0603]  (hidden comment: [Res] SMD Resistor)
U1  ESP32-S2FN4R2  [[MCU] ESP32-S2]
U9  W25Q128JVS  [[Mem] 16Mb Flash Memory]
X1  USB-C  [[Port] USB-C]
Y1  40MHz Crystal  [[XTAL] SMD 40MHz]  (value not drawn)

### Blocks framed on the sheet
USB-C Connection: R2 R3 R24#1 R33 X1
SMA Antenna: A1 C1 C2 L1
16MB Flash Memory: C43 U9
VDD3P3-A Pins: C30-C33 L6
ESP32 Power Up Pin: C36 R25#1

### Nets
+3V3: C31.2 C32.2 C33.2 C34.2 C35.2 C37.2 C38.2 C39.2 C40.2 C41.2 C42.2 C43.2 L6.1 R23#1.1 R25#1.1 U1.1(VDDA_1) U1.20(VDD3P3) U1.27(VDD3P3) U1.30(VDD_SPI) U1.45(VDD3P3) U1.51(VDDA_2) U1.54(VDDA_3) U9.8(VCC)
Earth: X1.MH
GND: A1.2 A1.3 A1.4 A1.5 C1.1 C2.1 C3.1 C4.1 C30.1 C31.1 C32.1 C33.1 C34.1 C35.1 C36.1 C37.1 C38.1 C39.1 C40.1 C41.1 C42.1 C43.1 R24#1.1 R33.2 U1.57(EP) U9.4(GND) X1.A1(GND) X1.A12(GND) X1.B1(GND) X1.B12(GND) Y1.2(GND) Y1.4(GND)
DAC2: R23#1.2 U1.24(DAC_2)
ESP32-SPI-CLK: U1.34(SPICLK) U9.6(CLK)
ESP32-SPI-CS0: U1.33(SPICS0) U9.1(~{CS})
ESP32-SPI-D: U1.36(SPID) U9.5(DI)
ESP32-SPI-HD: U1.31(SPIHD) U9.7(~{Reset})
ESP32-SPI-Q: U1.35(SPIQ) U9.2(DO)
ESP32-SPI-WP: U1.32(SPIWP) U9.3(~{WP})
ESP32-USB-5V-VIN: X1.A4(VBUS1) X1.A9(VBUS2) X1.B4(VBUS3) X1.B9(VBUS4)
ESP-PU: C36.2 R25#1.2 U1.56(CHIP_PU)
ESP-XTAL1: C3.2 R1.2 U1.53(XTAL_P) Y1.1(XTAL1)
ESP-XTAL2: C4.2 R1.1 U1.52(XTAL_N) Y1.3(XTAL2)
ESP_D_N: R2.1 X1.A7(D1-) X1.B7(D2-)
ESP_D_P: R3.1 X1.A6(D1+) X1.B6(D2+)
ESP_DX_N: R2.2 U1.25(GPIO19)
ESP_DX_P: R3.2 U1.26(GPIO20)
LNA-In: C2.2 L1.2 U1.2(LNA_IN)
VDD3P3-A: C30.2 L6.2 U1.3(VDD3P3_1) U1.4(VDD3P3_2)
NetA1_1: A1.1(Ant) C1.2 L1.1
NetR24#1_2: R24#1.2 X1.A5(CC1)
NetR33_1: R33.1 X1.B5(CC2)

Not connected (* = marked no-connect by the designer): U1 5(GPIO0) 6(GPIO1) 7(GPIO2) 8(GPIO3) 9(GPIO4) 10(GPIO5) 11(GPIO6) 12(GPIO7) 13(GPIO8) 14(GPIO9) 15(GPIO10) 16(GPIO11) 17(GPIO12) 18(GPIO13) 19(GPIO14) 21(XTAL_32K_P) 22(XTAL_32K_N) 23(DAC_1) 28(GPIO21) 29(SPICS1) 37(GPIO33) 38(GPIO34) 39(GPIO35) 40(GPIO36) 41(GPIO37) 42(GPIO38) 43(MTCK) 44(MTD0) 46(MTDI) 47(MTMS) 48(U0TXD) 49(U0RXD) 50(GPIO45) 55(GPIO46); X1 A2(TX1+) A3(TX1-) A8(SBU1) A10(RX2-) A11(RX2+) B2(TX2+) B3(TX2-) B8(SBU2) B10(RX1-) B11(RX1+)

### Layout directives
differential pair: ESP_D_N, ESP_D_P, ESP_DX_P
differential pair; differential pair class USB_Pairs: ESP_DX_N
net class nRF Signal: LNA-In, NetA1_1

### Notes on the sheet
- Reference schematic for ESP32-S2 <https://docs.espressif.com/projects/esp-hardware-design-guidelines/en/latest/esp32s2/_images/esp32s2-sche-core.png>
- C1 = C2 = 2*(CL-Cstray) <https://microchip.my.site.com/s/article/Calculating-crystal-load-capacitor>
- XTAL
- CL = 8pF, Cstray = 5pF
- Pin 1
- Pin 51
- Pin 54
- Pin 20
- Pin 27
- Pin 45
- Pin 24
- Pin 30
- VDDA Pins
- VDD3P3-B Pins
- Misc Power Pins
- (in symbol [MCU] ESP32-S2) ESP32-S2
- (in symbol [XTAL] SMD 40MHz) 40MHz

### Library data of the parts
A1 = [SMA] RP-SMA 90deg Jack: PCB.RPSMAFRA.HT; Supplier 1: DigiKey; Supplier Part Number 1: 931-1360-ND
C1-C4 C30-C34 C36-C38 C41 = [Cap] SMD Nonpolarized: Supplier 1: DigiKey
  C1 C2: Supplier Part Number 1: 4713-CHV0603N2501R2BCT-ND
  C3 C4: Supplier Part Number 1: 311-1055-1-ND
  C30 C31: Supplier Part Number 1: 478-600S1R8BT250XT4KCT-ND
  C32 C34 C36 C38 C41: Supplier Part Number 1: 1276-6524-1-ND
  C33: Supplier Part Number 1: 587-3258-1-ND
  C37: Supplier Part Number 1: 490-1427-1-ND
L1 L6 = [Inductor] SMD Inductor: JLC Part #: *; Mouser Part #: *; Supplier 1: DigiKey
  L1: Supplier Part Number 1: 732-7447860027GCT-ND
  L6: Supplier Part Number 1: 490-LQW18AS2N0J00DCT-ND
R1-R3 R23#1 R24#1 R25#1 R33 = [Res] SMD Resistor: Generic; Supplier 1: DigiKey
  R1: Supplier Part Number 1: YAG4498CT-ND
  R2: Supplier Part Number 1: 749-1631-1-ND
  R23#1 R25#1: Supplier Part Number 1: 311-10.0KHRCT-ND
  R24#1 R33: Supplier Part Number 1: A129709CT-ND
U1 = [MCU] ESP32-S2: Supplier 1: DigiKey; Supplier Part Number 1: 1965-ESP32-S2FN4R2CT-ND
U9 = [Mem] 16Mb Flash Memory: W25Q128JVSIQ TR; Supplier 1: DigiKey; Supplier Part Number 1: 256-W25Q128JVSIQTRCT-ND
X1 = [Port] USB Type-C: Supplier 1: DigiKey; Supplier Part Number 1: 670-3104-1-ND
Y1 = [XTAL] SMD 40MHz: CX2016DB40000D0FLJCC; Supplier 1: DigiKey; Supplier Part Number 1: 478-CX2016DB40000D0FLJCCDKR-ND
C35 C39 C40 C42 C43 = [Cap] SMD Nonpolarized: Supplier 1: DigiKey; Supplier Part Number 1: 311-1088-6-ND

## Sheet USB Hub.SchDoc
size B; SheetNumber: 6; SheetTotal: 9
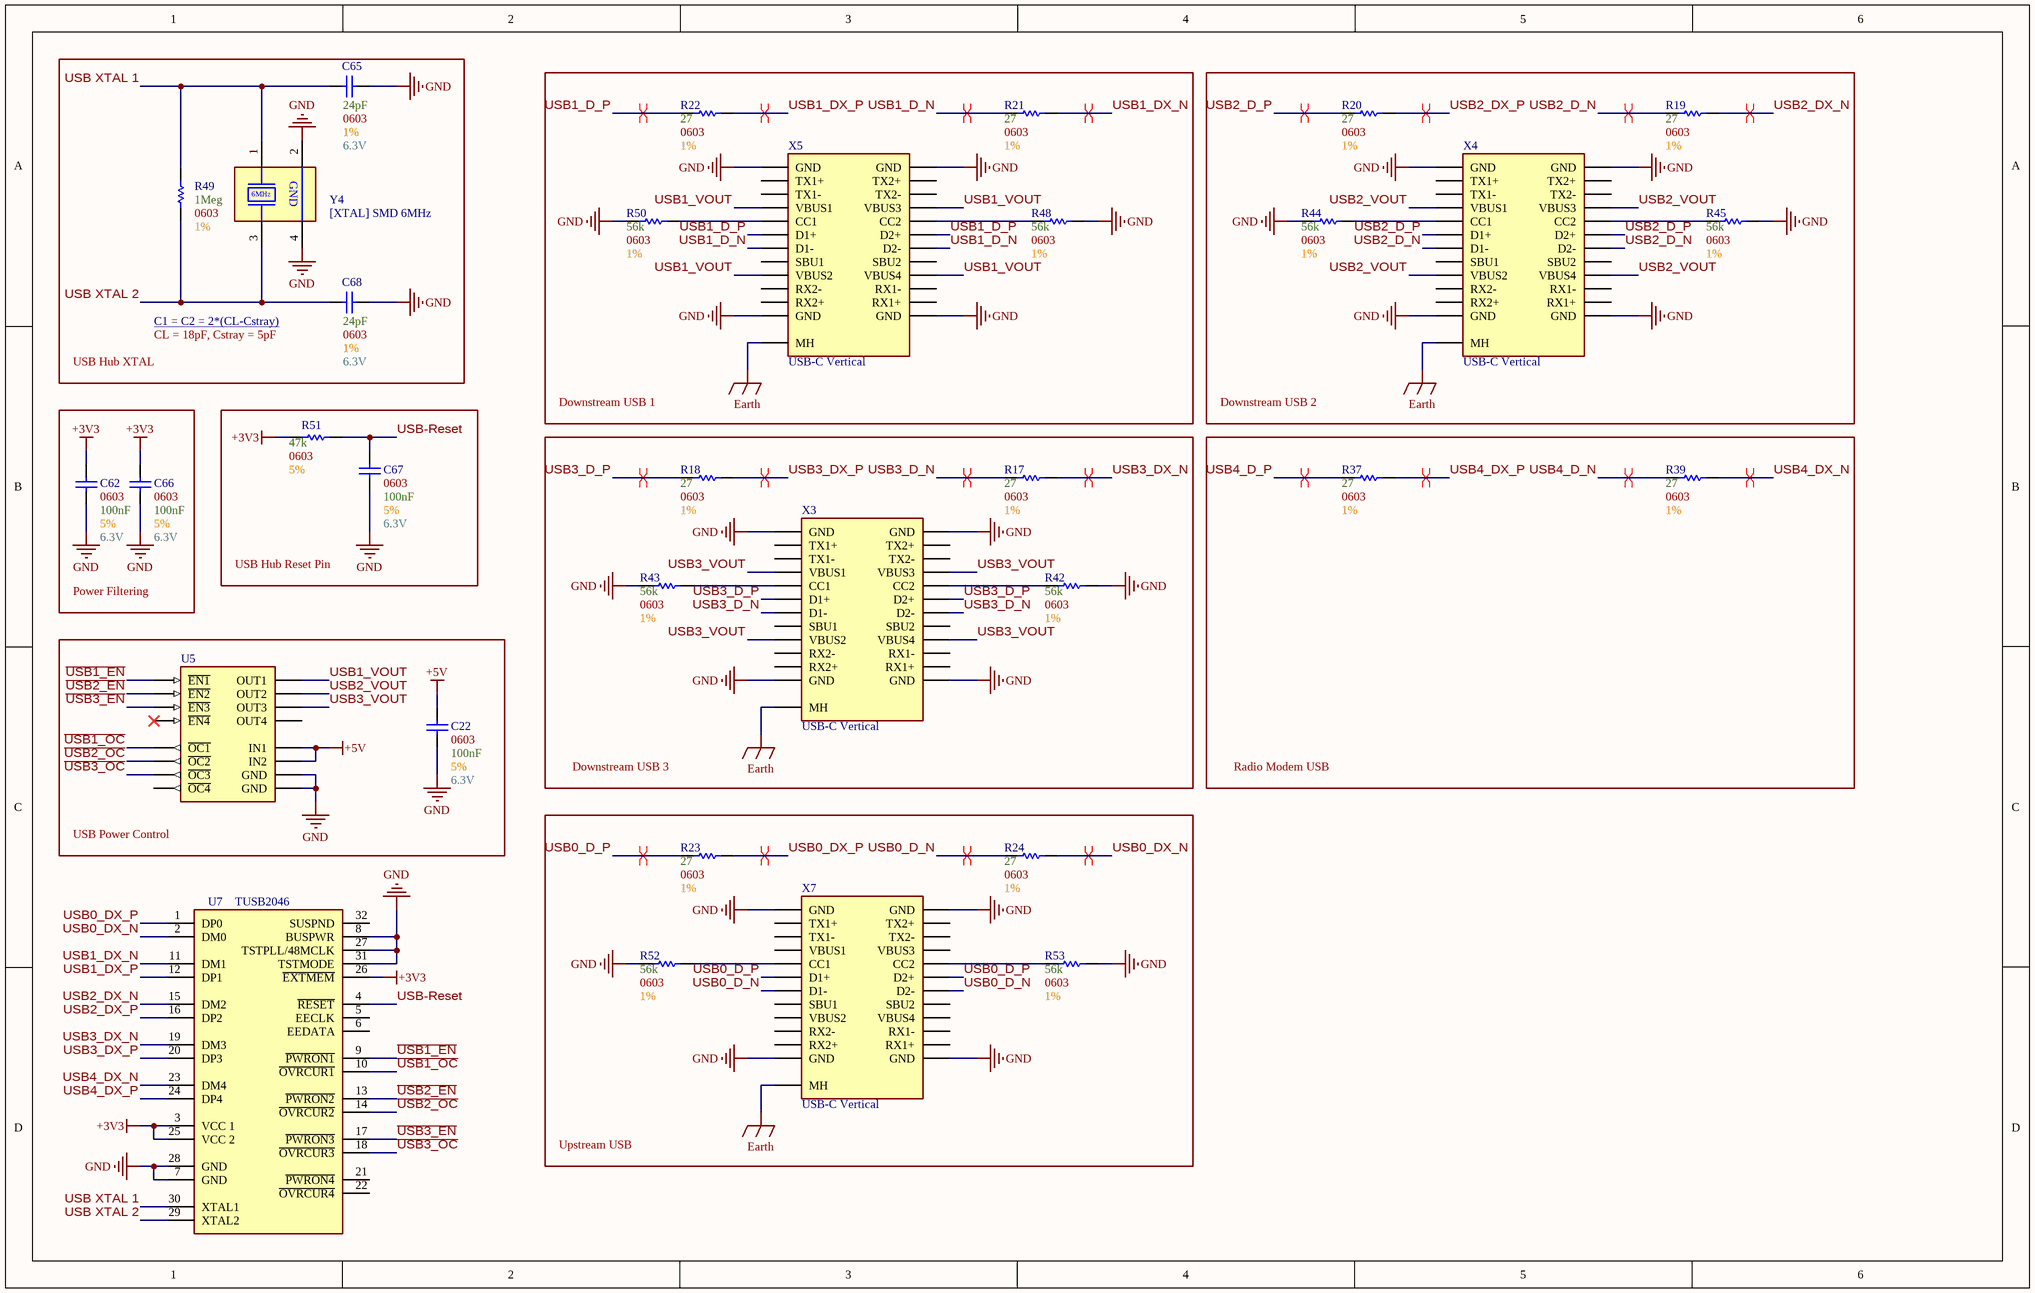
[diagram p5: USB Hub.SchDoc]

### Parts
(Parts that share a designator on the sheet are numbered #1, #2 ... from top to bottom, then left to right.)
C22  Size Package: 0603  Capacitance: 100nF  Voltage: 6.3V  Tolerance: 5%  [[Cap] SMD 0603]  (hidden comment: [Cap] SMD Nonpolarized)
C62  Size Package: 0603  Capacitance: 100nF  Voltage: 6.3V  Tolerance: 5%  [[Cap] SMD 0603]  (hidden comment: [Cap] SMD Nonpolarized)
C65  Tolerance: 1%  Size Package: 0603  Capacitance: 24pF  Voltage: 6.3V  [[Cap] SMD 0603]  (hidden comment: SMD Nonpolarized)
C66  Size Package: 0603  Capacitance: 100nF  Voltage: 6.3V  Tolerance: 5%  [[Cap] SMD 0603]  (hidden comment: [Cap] SMD Nonpolarized)
C67  Size Package: 0603  Capacitance: 100nF  Voltage: 6.3V  Tolerance: 5%  [[Cap] SMD 0603]  (hidden comment: [Cap] SMD Nonpolarized)
C68  Tolerance: 1%  Size Package: 0603  Capacitance: 24pF  Voltage: 6.3V  [[Cap] SMD 0603]  (hidden comment: SMD Nonpolarized)
R17  Tolerance: 1%  Resistance: 27  Size Package: 0603  [[Res] SMD 0603]  (hidden comment: [Res] SMD Resistor)
R18  Tolerance: 1%  Resistance: 27  Size Package: 0603  [[Res] SMD 0603]  (hidden comment: [Res] SMD Resistor)
R19  Tolerance: 1%  Resistance: 27  Size Package: 0603  [[Res] SMD 0603]  (hidden comment: [Res] SMD Resistor)
R20  Tolerance: 1%  Resistance: 27  Size Package: 0603  [[Res] SMD 0603]  (hidden comment: [Res] SMD Resistor)
R21  Tolerance: 1%  Resistance: 27  Size Package: 0603  [[Res] SMD 0603]  (hidden comment: [Res] SMD Resistor)
R22  Tolerance: 1%  Resistance: 27  Size Package: 0603  [[Res] SMD 0603]  (hidden comment: [Res] SMD Resistor)
R23#2  Tolerance: 1%  Resistance: 27  Size Package: 0603  [[Res] SMD 0603]  (hidden comment: [Res] SMD Resistor)
R24#2  Tolerance: 1%  Resistance: 27  Size Package: 0603  [[Res] SMD 0603]  (hidden comment: [Res] SMD Resistor)
R37  Tolerance: 1%  Resistance: 27  Size Package: 0603  [[Res] SMD 0603]  (hidden comment: [Res] SMD Resistor)
R39  Tolerance: 1%  Resistance: 27  Size Package: 0603  [[Res] SMD 0603]  (hidden comment: [Res] SMD Resistor)
R42  Tolerance: 1%  Resistance: 56k  Size Package: 0603  [[Res] SMD 0603]  (hidden comment: [Res] SMD Resistor)
R43  Tolerance: 1%  Resistance: 56k  Size Package: 0603  [[Res] SMD 0603]  (hidden comment: [Res] SMD Resistor)
R44  Tolerance: 1%  Resistance: 56k  Size Package: 0603  [[Res] SMD 0603]  (hidden comment: [Res] SMD Resistor)
R45  Tolerance: 1%  Resistance: 56k  Size Package: 0603  [[Res] SMD 0603]  (hidden comment: [Res] SMD Resistor)
R48  Tolerance: 1%  Resistance: 56k  Size Package: 0603  [[Res] SMD 0603]  (hidden comment: [Res] SMD Resistor)
R49  Tolerance: 1%  Resistance: 1Meg  Size Package: 0603  [[Res] SMD 0603]  (hidden comment: [Res] SMD Resistor)
R50  Tolerance: 1%  Resistance: 56k  Size Package: 0603  [[Res] SMD 0603]  (hidden comment: [Res] SMD Resistor)
R51  Tolerance: 5%  Resistance: 47k  Size Package: 0603  [[Res] SMD 0603]  (hidden comment: [Res] SMD Resistor)
R52  Tolerance: 1%  Resistance: 56k  Size Package: 0603  [[Res] SMD 0603]  (hidden comment: [Res] SMD Resistor)
R53  Tolerance: 1%  Resistance: 56k  Size Package: 0603  [[Res] SMD 0603]  (hidden comment: [Res] SMD Resistor)
U5  [IC] USB Hub Power Distribution  [[IC] USB Hub Power Distribution]  (value not drawn)
U7  TUSB2046  [[IC] USB Hub 4port (2)]
X3  USB-C Vertical  [[Port] USB-C Vertical]
X4  USB-C Vertical  [[Port] USB-C Vertical]
X5  USB-C Vertical  [[Port] USB-C Vertical]
X7  USB-C Vertical  [[Port] USB-C Vertical]
Y4  [XTAL] SMD 6MHz  [[XTAL] SMD 6MHz]

### Blocks framed on the sheet
Downstream USB 1: R21 R22 R48 R50 X5
Downstream USB 2: R19 R20 R44 R45 X4
Power Filtering: C62 C66
USB Hub Reset Pin: C67 R51
Downstream USB 3: R17 R18 R42 R43 X3
Radio Modem USB: R37 R39
USB Power Control: C22 U5
Upstream USB: R23#2 R24#2 R52 R53 X7

### Nets
+3V3: C62.2 C66.2 R51.1 U7.3(VCC_1) U7.25(VCC_2) U7.26(~{EXTMEM})
+5V: C22.2 U5.2(IN1) U5.6(IN2)
Earth: X3.MH X4.MH X5.MH X7.MH
GND: C22.1 C62.1 C65.2 C66.1 C67.1 C68.2 R42.2 R43.1 R44.1 R45.2 R48.2 R50.1 R52.1 R53.2 U5.1(GND) U5.5(GND) U7.7(GND) U7.8(BUSPWR) U7.27(TSTPLL/48MCLK) U7.28(GND) U7.31(TSTMODE) X3.A1(GND) X3.A12(GND) X3.B1(GND) X3.B12(GND) X4.A1(GND) X4.A12(GND) X4.B1(GND) X4.B12(GND) X5.A1(GND) X5.A12(GND) X5.B1(GND) X5.B12(GND) X7.A1(GND) X7.A12(GND) X7.B1(GND) X7.B12(GND) Y4.2(GND) Y4.4(GND)
~{USB1_EN}: U5.3(~{EN1}) U7.9(~{PWRON1})
~{USB1_OC}: U5.16(~{OC1}) U7.10(~{OVRCUR1})
~{USB2_EN}: U5.4(~{EN2}) U7.13(~{PWRON2})
~{USB2_OC}: U5.13(~{OC2}) U7.14(~{OVRCUR2})
~{USB3_EN}: U5.7(~{EN3}) U7.17(~{PWRON3})
~{USB3_OC}: U5.12(~{OC3}) U7.18(~{OVRCUR3})
USB0_D_N: R24#2.1 X7.A7(D1-) X7.B7(D2-)
USB0_D_P: R23#2.1 X7.A6(D1+) X7.B6(D2+)
USB0_DX_N: R24#2.2 U7.2(DM0)
USB0_DX_P: R23#2.2 U7.1(DP0)
USB1_D_N: R21.1 X5.A7(D1-) X5.B7(D2-)
USB1_D_P: R22.1 X5.A6(D1+) X5.B6(D2+)
USB1_DX_N: R21.2 U7.11(DM1)
USB1_DX_P: R22.2 U7.12(DP1)
USB1_VOUT: U5.15(OUT1) X5.A4(VBUS1) X5.A9(VBUS2) X5.B4(VBUS3) X5.B9(VBUS4)
USB2_D_N: R19.1 X4.A7(D1-) X4.B7(D2-)
USB2_D_P: R20.1 X4.A6(D1+) X4.B6(D2+)
USB2_DX_N: R19.2 U7.15(DM2)
USB2_DX_P: R20.2 U7.16(DP2)
USB2_VOUT: U5.14(OUT2) X4.A4(VBUS1) X4.A9(VBUS2) X4.B4(VBUS3) X4.B9(VBUS4)
USB3_D_N: R17.1 X3.A7(D1-) X3.B7(D2-)
USB3_D_P: R18.1 X3.A6(D1+) X3.B6(D2+)
USB3_DX_N: R17.2 U7.19(DM3)
USB3_DX_P: R18.2 U7.20(DP3)
USB3_VOUT: U5.11(OUT3) X3.A4(VBUS1) X3.A9(VBUS2) X3.B4(VBUS3) X3.B9(VBUS4)
USB4_D_N: R39.1
USB4_D_P: R37.1
USB4_DX_N: R39.2 U7.23(DM4)
USB4_DX_P: R37.2 U7.24(DP4)
USB XTAL 1: C65.1 R49.2 U7.30(XTAL1) Y4.1(XTAL1)
USB XTAL 2: C68.1 R49.1 U7.29(XTAL2) Y4.3(XTAL2)
USB-Reset: C67.2 R51.2 U7.4(~{RESET})
NetR42_1: R42.1 X3.B5(CC2)
NetR43_2: R43.2 X3.A5(CC1)
NetR44_2: R44.2 X4.A5(CC1)
NetR45_1: R45.1 X4.B5(CC2)
NetR48_1: R48.1 X5.B5(CC2)
NetR50_2: R50.2 X5.A5(CC1)
NetR52_2: R52.2 X7.A5(CC1)
NetR53_1: R53.1 X7.B5(CC2)

Not connected (* = marked no-connect by the designer): U5 8(~{EN4})* 9(~{OC4}) 10(OUT4); U7 5(EECLK) 6(EEDATA) 21(~{PWRON4}) 22(~{OVRCUR4}) 32(SUSPND); X3 A2(TX1+) A3(TX1-) A8(SBU1) A10(RX2-) A11(RX2+) B2(TX2+) B3(TX2-) B8(SBU2) B10(RX1-) B11(RX1+); X4 A2(TX1+) A3(TX1-) A8(SBU1) A10(RX2-) A11(RX2+) B2(TX2+) B3(TX2-) B8(SBU2) B10(RX1-) B11(RX1+); X5 A2(TX1+) A3(TX1-) A8(SBU1) A10(RX2-) A11(RX2+) B2(TX2+) B3(TX2-) B8(SBU2) B10(RX1-) B11(RX1+); X7 A2(TX1+) A3(TX1-) A4(VBUS1) A8(SBU1) A9(VBUS2) A10(RX2-) A11(RX2+) B2(TX2+) B3(TX2-) B4(VBUS3) B8(SBU2) B9(VBUS4) B10(RX1-) B11(RX1+)

### Layout directives
differential pair; differential pair class USB_Pairs: USB0_D_N, USB0_D_P, USB0_DX_N, USB0_DX_P, USB1_D_N, USB1_D_P, USB1_DX_N, USB1_DX_P, USB2_D_N, USB2_D_P, USB2_DX_N, USB2_DX_P, USB3_D_N, USB3_D_P, USB3_DX_N, USB3_DX_P, USB4_D_N, USB4_D_P, USB4_DX_N, USB4_DX_P

### Notes on the sheet
- USB Hub XTAL
- (near C68) C1 = C2 = 2*(CL-Cstray) <https://microchip.my.site.com/s/article/Calculating-crystal-load-capacitor>
- CL = 18pF, Cstray = 5pF
- (in symbol [XTAL] SMD 6MHz) 6MHz

### Library data of the parts
C65 C68 = [Cap] SMD Nonpolarized: Supplier 1: DigiKey; Supplier Part Number 1: 490-GCM1885C2A240JA16DCT-ND
R17-R22 R23#2 R24#2 R37 R39 R42-R45 R48-R53 = [Res] SMD Resistor: Generic; Supplier 1: DigiKey
  R17-R22 R23#2 R24#2 R37 R39: Supplier Part Number 1: 749-1631-1-ND
  R42-R45 R48 R50 R52 R53: Supplier Part Number 1: A129709CT-ND
  R49: Supplier Part Number 1: 311-1.00MHRDKR-ND
  R51: Supplier Part Number 1: 311-4.70KHRDKR-ND
U7 = [IC] USB Hub 4port (2): TUSB2046BVFR; Supplier 1: DigiKey; Supplier Part Number 1: 296-27131-1-ND
X3-X5 X7 = [Port] USB Type-C Vertical: Supplier 1: DigiKey; Supplier Part Number 1: 277-1332646CT-ND
Y4 = [XTAL] SMD 6MHz: ECS-060-18-20BM-JEN-TR; Supplier 1: DigiKey; Supplier Part Number 1: XC2349CT-ND
C22 C62 C66 C67 = [Cap] SMD Nonpolarized: Supplier 1: DigiKey; Supplier Part Number 1: 311-1088-6-ND
U5 = [IC] USB Hub Power Distribution: Supplier 1: DigiKey; Supplier Part Number 1: 296-26909-1-ND

## Sheet Safety Devices.SchDoc
size A; SheetNumber: 7; SheetTotal: 9
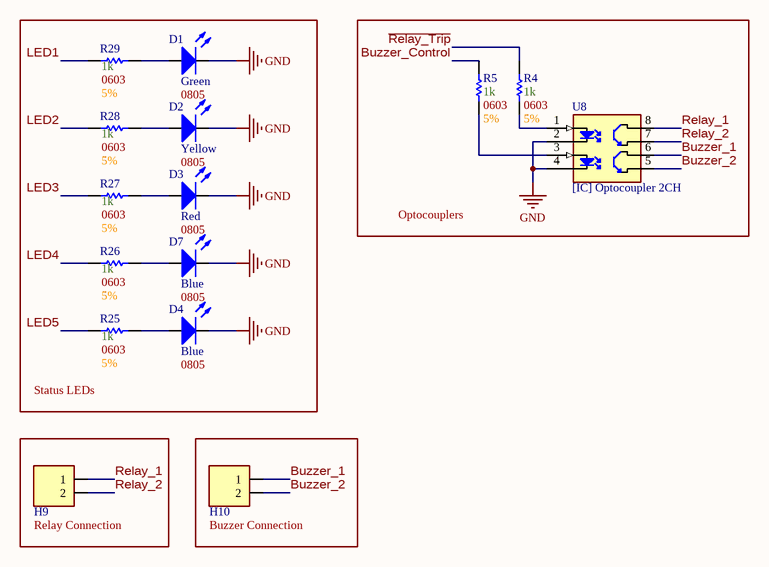
[diagram p6: Safety Devices.SchDoc]

### Parts
(Parts that share a designator on the sheet are numbered #1, #2 ... from top to bottom, then left to right.)
D1  Color: Green  Size Package: 0805  [[LED] SMD 0805]  (hidden comment: SMD LED)
D2  Color: Yellow  Size Package: 0805  [[LED] SMD 0805]  (hidden comment: SMD LED)
D3  Color: Red  Size Package: 0805  [[LED] SMD 0805]  (hidden comment: SMD LED)
D4  Color: Blue  Size Package: 0805  [[LED] SMD 0805]  (hidden comment: SMD LED)
D7  Color: Blue  Size Package: 0805  [[LED] SMD 0805]  (hidden comment: SMD LED)
H9  1x2 Male  [[Header] Shrouded 1x2 Male]  (value not drawn)
H10  1x2 Male  [[Header] Shrouded 1x2 Male]  (value not drawn)
R4  Resistance: 1k  Size Package: 0603  Tolerance: 5%  [[Res] SMD 0603]  (hidden comment: [Res] SMD Resistor)
R5  Resistance: 1k  Size Package: 0603  Tolerance: 5%  [[Res] SMD 0603]  (hidden comment: [Res] SMD Resistor)
R25#2  Resistance: 1k  Size Package: 0603  Tolerance: 5%  [[Res] SMD 0603]  (hidden comment: [Res] SMD Resistor)
R26  Resistance: 1k  Size Package: 0603  Tolerance: 5%  [[Res] SMD 0603]  (hidden comment: [Res] SMD Resistor)
R27  Resistance: 1k  Size Package: 0603  Tolerance: 5%  [[Res] SMD 0603]  (hidden comment: [Res] SMD Resistor)
R28  Resistance: 1k  Size Package: 0603  Tolerance: 5%  [[Res] SMD 0603]  (hidden comment: [Res] SMD Resistor)
R29  Resistance: 1k  Size Package: 0603  Tolerance: 5%  [[Res] SMD 0603]  (hidden comment: [Res] SMD Resistor)
U8  [IC] Optocoupler 2CH  [[IC] Optocoupler 2CH]

### Blocks framed on the sheet
Status LEDs: D1-D4 D7 R25#2 R26-R29
Optocouplers: R4 R5 U8
Relay Connection: H9
Buzzer Connection: H10

### Nets
GND: D1.2(Cathode) D2.2(Cathode) D3.2(Cathode) D4.2(Cathode) D7.2(Cathode) U8.2(CATHODE_1) U8.4(CATHODE_2)
~{Relay_Trip}: R4.1
Buzzer_1: H10.1 U8.6(Collector)
Buzzer_2: H10.2 U8.5(Emitter)
Buzzer_Control: R5.2
LED1: R29.2
LED2: R28.2
LED3: R27.2
LED4: R26.2
LED5: R25#2.2
Relay_1: H9.1 U8.8(Collector)
Relay_2: H9.2 U8.7(Emitter)
NetD1_1: D1.1(Anode) R29.1
NetD2_1: D2.1(Anode) R28.1
NetD3_1: D3.1(Anode) R27.1
NetD4_1: D4.1(Anode) R25#2.1
NetD7_1: D7.1(Anode) R26.1
NetR4_2: R4.2 U8.1(ANODE_1)
NetR5_1: R5.1 U8.3(ANODE_2)

### Library data of the parts
D1-D4 D7 = [LED] SMD: Generic; Part #: *; Supplier 1: DigiKey
  D1: Supplier Part Number 1: 475-LGR971-KN-1CT-ND
  D2: Supplier Part Number 1: 475-LYR976-PS-36-0-20-R18CT-ND
  D3: Supplier Part Number 1: 475-LSR976-NR-1CT-ND
  D4 D7: Supplier Part Number 1: 732-4982-1-ND
H9 H10 = [Header] Shrouded 1x2 Male: 0705430036 / Mates with 0050579402; Supplier 1: DigiKey; Supplier 2: DigiKey; Supplier Part Number 2: WM2900-ND; Supplier Part Number 1: WM4824-ND
R4 R5 R25#2 R26-R29 = [Res] SMD Resistor: Generic; Supplier 1: DigiKey; Supplier Part Number 1: RMCF0603FT1K00DKR-ND
U8 = [IC] Optocoupler 2CH: Supplier 1: DigiKey; Supplier Part Number 1: 160-2040-1-ND

## Sheet Motor Drivers.SchDoc
size A; SheetNumber: 8; SheetTotal: 9
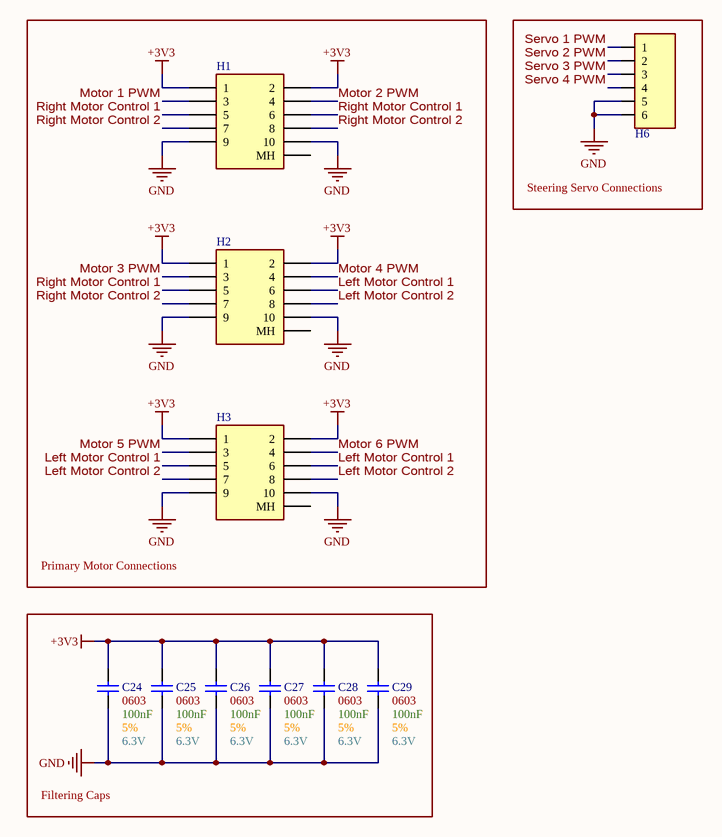
[diagram p7: Motor Drivers.SchDoc]

### Parts
C24  Size Package: 0603  Capacitance: 100nF  Voltage: 6.3V  Tolerance: 5%  [[Cap] SMD 0603]  (hidden comment: [Cap] SMD Nonpolarized)
C25  Size Package: 0603  Capacitance: 100nF  Voltage: 6.3V  Tolerance: 5%  [[Cap] SMD 0603]  (hidden comment: [Cap] SMD Nonpolarized)
C26  Size Package: 0603  Capacitance: 100nF  Voltage: 6.3V  Tolerance: 5%  [[Cap] SMD 0603]  (hidden comment: [Cap] SMD Nonpolarized)
C27  Size Package: 0603  Capacitance: 100nF  Voltage: 6.3V  Tolerance: 5%  [[Cap] SMD 0603]  (hidden comment: [Cap] SMD Nonpolarized)
C28  Size Package: 0603  Capacitance: 100nF  Voltage: 6.3V  Tolerance: 5%  [[Cap] SMD 0603]  (hidden comment: [Cap] SMD Nonpolarized)
C29  Size Package: 0603  Capacitance: 100nF  Voltage: 6.3V  Tolerance: 5%  [[Cap] SMD 0603]  (hidden comment: [Cap] SMD Nonpolarized)
H1  [Header] Shrouded 2x5 SMD  [[Header] Shrouded 2x5 SMD]  (value not drawn)
H2  [Header] Shrouded 2x5 SMD  [[Header] Shrouded 2x5 SMD]  (value not drawn)
H3  [Header] Shrouded 2x5 SMD  [[Header] Shrouded 2x5 SMD]  (value not drawn)
H6  [Header] Shrouded 1x6 Male  [[Header] Shrouded 1x6 Male]  (value not drawn)

### Blocks framed on the sheet
Primary Motor Connections: H1-H3
Steering Servo Connections: H6
Filtering Caps: C24-C29

### Nets
+3V3: C24.2 C25.2 C26.2 C27.2 C28.2 C29.2 H1.1 H1.2 H2.1 H2.2 H3.1 H3.2
GND: C24.1 C25.1 C26.1 C27.1 C28.1 C29.1 H1.9 H1.10 H2.9 H2.10 H3.9 H3.10 H6.5 H6.6
Left Motor Control 1: H2.6 H3.5 H3.6
Left Motor Control 2: H2.8 H3.7 H3.8
Motor 1 PWM: H1.3
Motor 2 PWM: H1.4
Motor 3 PWM: H2.3
Motor 4 PWM: H2.4
Motor 5 PWM: H3.3
Motor 6 PWM: H3.4
Right Motor Control 1: H1.5 H1.6 H2.5
Right Motor Control 2: H1.7 H1.8 H2.7
Servo 1 PWM: H6.1
Servo 2 PWM: H6.2
Servo 3 PWM: H6.3
Servo 4 PWM: H6.4

Not connected (* = marked no-connect by the designer): H1 X(MH); H2 X(MH); H3 X(MH)

### Library data of the parts
H6 = [Header] Shrouded 1x6 Male: 0705430005 / Mates with 0050579406; Supplier 1: DigiKey; Supplier 2: DigiKey; Supplier Part Number 1: WM4804-ND; Supplier Part Number 2: WM2904-ND
C24-C29 = [Cap] SMD Nonpolarized: Supplier 1: DigiKey; Supplier Part Number 1: 311-1088-6-ND
H1-H3 = [Header] Shrouded 2x5 SMD: Supplier 1: DigiKey; Supplier Part Number 1: WM4227-ND

## Sheet Peripheral Connections.SchDoc
size A; SheetNumber: 9; SheetTotal: 9
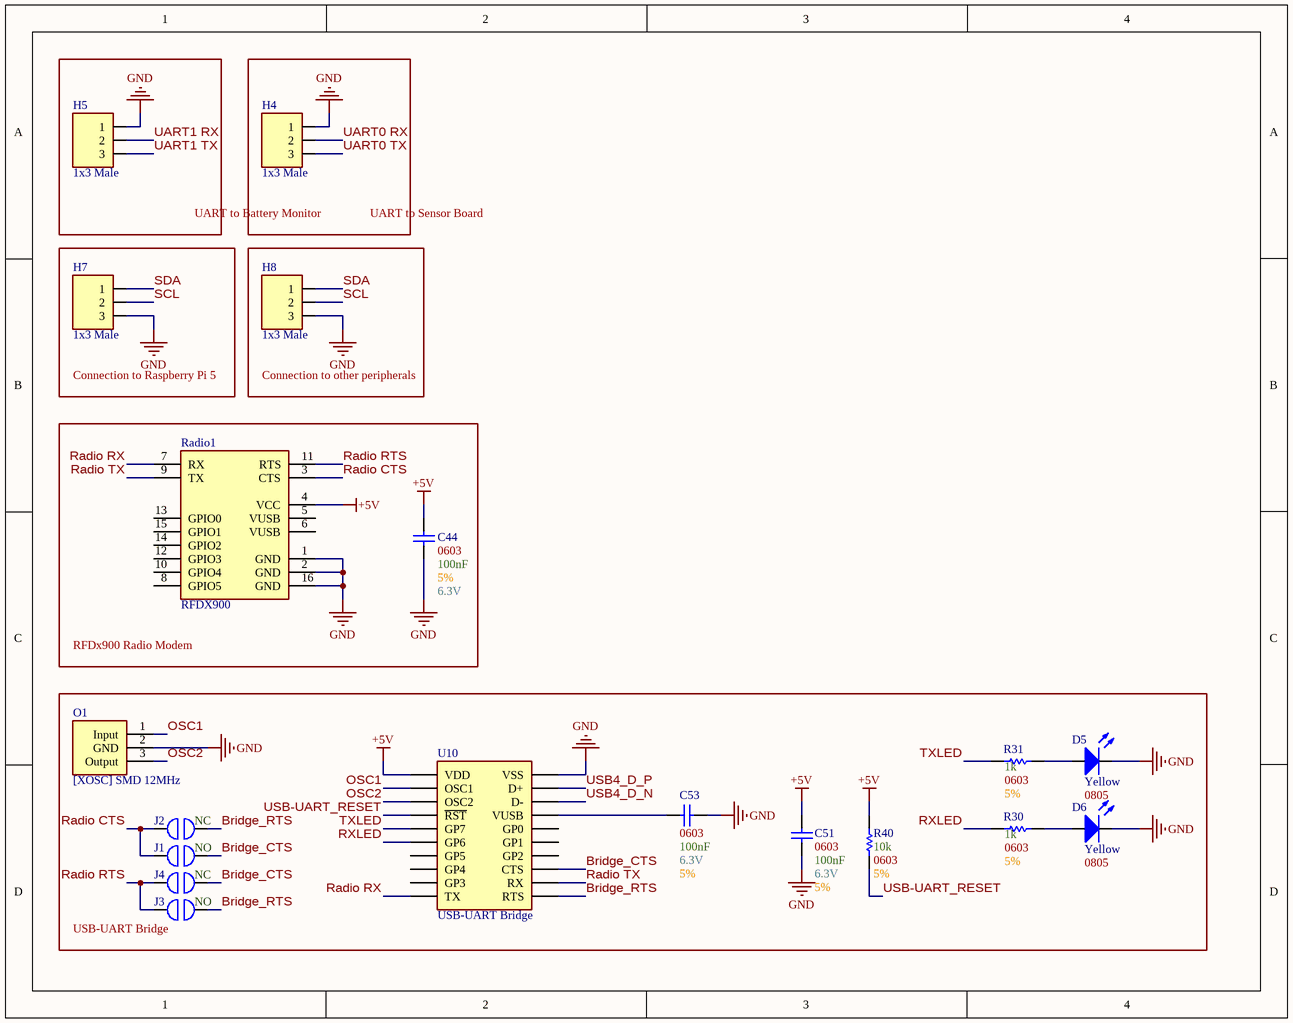
[diagram p8: Peripheral Connections.SchDoc]

### Parts
C44  Size Package: 0603  Capacitance: 100nF  Voltage: 6.3V  Tolerance: 5%  [[Cap] SMD 0603]  (hidden comment: [Cap] SMD Nonpolarized)
C51  Size Package: 0603  Capacitance: 100nF  Voltage: 6.3V  Tolerance: 5%  [[Cap] SMD 0603]  (hidden comment: [Cap] SMD Nonpolarized)
C53  Size Package: 0603  Capacitance: 100nF  Voltage: 6.3V  Tolerance: 5%  [[Cap] SMD 0603]  (hidden comment: [Cap] SMD Nonpolarized)
D5  Color: Yellow  Size Package: 0805  [[LED] SMD 0805]  (hidden comment: SMD LED)
D6  Color: Yellow  Size Package: 0805  [[LED] SMD 0805]  (hidden comment: SMD LED)
H4  1x3 Male  [[Header] Shrouded 1x3 Male]
H5  1x3 Male  [[Header] Shrouded 1x3 Male]
H7  1x3 Male  [[Header] Shrouded 1x3 Male]
H8  1x3 Male  [[Header] Shrouded 1x3 Male]
J1  NO/NC: NO  [[Jumper] Solderable Jumper]  (hidden comment: [Jump] SMD Jumper)  (no BOM)
J2  NO/NC: NC  [[Jumper] Solderable Jumper]  (hidden comment: [Jump] SMD Jumper)  (no BOM)
J3  NO/NC: NO  [[Jumper] Solderable Jumper]  (hidden comment: [Jump] SMD Jumper)  (no BOM)
J4  NO/NC: NC  [[Jumper] Solderable Jumper]  (hidden comment: [Jump] SMD Jumper)  (no BOM)
O1  [XOSC] SMD 12MHz  [[XOSC] SMD 12MHz]
R30  Resistance: 1k  Size Package: 0603  Tolerance: 5%  [[Res] SMD 0603]  (hidden comment: [Res] SMD Resistor)
R31  Resistance: 1k  Size Package: 0603  Tolerance: 5%  [[Res] SMD 0603]  (hidden comment: [Res] SMD Resistor)
R40  Resistance: 10k  Size Package: 0603  Tolerance: 5%  [[Res] SMD 0603]  (hidden comment: [Res] SMD Resistor)
Radio1  RFDX900  [[Device] RFDX900 Radio SMD Mount]
U10  USB-UART Bridge  [[IC] USB-UART Bridge]

### Blocks framed on the sheet
UART to Battery Monitor: H5
UART to Sensor Board: H4
Connection to Raspberry Pi 5: H7
Connection to other peripherals: H8
RFDx900 Radio Modem: C44 Radio1
USB-UART Bridge: C51 C53 D5 D6 J1-J4 O1 R30 R31 R40 U10

### Nets
+5V: C44.2 C51.2 R40.2 Radio1.4(VCC) U10.1(VDD)
GND: C44.1 C51.1 C53.1 D5.2(Cathode) D6.2(Cathode) H4.1 H5.1 H7.3 H8.3 O1.2(GND) Radio1.1(GND) Radio1.2(GND) Radio1.16(GND) U10.20(VSS)
Bridge_CTS: J1.2 J4.2 U10.13(CTS)
Bridge_RTS: J2.2 J3.2 U10.11(RTS)
OSC1: O1.1(Input) U10.2(OSC1)
OSC2: O1.3(Output) U10.3(OSC2)
Radio CTS: J1.1 J2.1 Radio1.3(CTS)
Radio RTS: J3.1 J4.1 Radio1.11(RTS)
Radio RX: Radio1.7(RX) U10.10(TX)
Radio TX: Radio1.9(TX) U10.12(RX)
RXLED: R30.2 U10.6(GP6)
SCL: H7.2 H8.2
SDA: H7.1 H8.1
TXLED: R31.2 U10.5(GP7)
UART0 RX: H4.2
UART0 TX: H4.3
UART1 RX: H5.2
UART1 TX: H5.3
USB4_D_N: U10.18(D-)
USB4_D_P: U10.19(D+)
USB-UART_RESET: R40.1 U10.4(~{RST})
NetC53_2: C53.2 U10.17(VUSB)
NetD5_1: D5.1(Anode) R31.1
NetD6_1: D6.1(Anode) R30.1

Not connected (* = marked no-connect by the designer): Radio1 5(VUSB) 6(VUSB) 8(GPIO5) 10(GPIO4) 12(GPIO3) 13(GPIO0) 14(GPIO2) 15(GPIO1); U10 7(GP5) 8(GP4) 9(GP3) 14(GP2) 15(GP1) 16(GP0)

### Library data of the parts
D5 D6 = [LED] SMD: Generic; Part #: *; Supplier 1: DigiKey; Supplier Part Number 1: 3147-B1701UY--20D000214U1930CT-ND
H4 H5 H7 H8 = [Header] Shrouded 1x3 Male: 070543-0037 / Mates with 005057-9403; Supplier 1: DigiKey; Supplier Part Number 1: WM4825-ND
  H7 H8: Supplier 2: DigiKey; Supplier Part Number 2: WM2901-ND
J1-J4 = [Jump] SMD Jumper: Solderable jumper
R30 R31 R40 = [Res] SMD Resistor: Generic; Supplier 1: DigiKey
  R30 R31: Supplier Part Number 1: RMCF0603FT1K00DKR-ND
  R40: Supplier Part Number 1: 311-10.0KHRDKR-ND
Radio1 = [Device] RFDX900 Radio: RFDX900 Long-Range RF Module; Supplier 1: DigiKey; Supplier Part Number 1: 609-71609-308LF-ND
U10 = [IC] USB-UART Bridge: MCP2200T-I/SO; Supplier 1: DigiKey; Supplier Part Number 1: MCP2200T-I/SOCT-ND
C44 C51 C53 = [Cap] SMD Nonpolarized: Supplier 1: DigiKey; Supplier Part Number 1: 311-1088-6-ND
O1 = [XOSC] SMD 12MHz: Supplier 1: DigiKey; Supplier Part Number 1: 490-17947-1-ND

## Nets that join several sheets
+3V3: Overview and Power (TP8.1), Power (5 pins), RP2350 (28 pins), NRF24L01P (7 pins), ESP32-S2 (23 pins), USB Hub (6 pins), Motor Drivers (12 pins)
+5V: Overview and Power (TP6.1), Power (7 pins), USB Hub (C22.2 U5.2 U5.6), Peripheral Connections (5 pins)
Earth: Overview and Power (6 pins), RP2350 (X2.MH), ESP32-S2 (X1.MH), USB Hub (X3.MH X4.MH X5.MH X7.MH)
GND: Overview and Power (L8.2 TP9.1), Power (10 pins), RP2350 (34 pins), NRF24L01P (33 pins), ESP32-S2 (32 pins), USB Hub (39 pins), Safety Devices (7 pins), Motor Drivers (14 pins), Peripheral Connections (14 pins)
~{Relay_Trip}: Overview and Power (TP1.1), RP2350 (U4.28), Safety Devices (R4.1)
~{USB1_EN}: Overview and Power (TP12.1), USB Hub (U5.3 U7.9)
~{USB1_OC}: Overview and Power (TP13.1), USB Hub (U5.16 U7.10)
Buzzer_Control: RP2350 (U4.27), Safety Devices (R5.2)
ESP32-USB-5V-VIN: Power (S3.3), ESP32-S2 (X1.A4 X1.A9 X1.B4 X1.B9)
LED1: RP2350 (U4.21), Safety Devices (R29.2)
LED2: RP2350 (U4.22), Safety Devices (R28.2)
LED3: RP2350 (U4.23), Safety Devices (R27.2)
LED4: RP2350 (U4.25), Safety Devices (R26.2)
LED5: RP2350 (U4.26), Safety Devices (R25#2.2)
Left Motor Control 1: RP2350 (U4.16), Motor Drivers (H2.6 H3.5 H3.6)
Left Motor Control 2: RP2350 (U4.17), Motor Drivers (H2.8 H3.7 H3.8)
Motor 1 PWM: RP2350 (U4.7), Motor Drivers (H1.3)
Motor 2 PWM: RP2350 (U4.6), Motor Drivers (H1.4)
Motor 3 PWM: RP2350 (U4.4), Motor Drivers (H2.3)
Motor 4 PWM: RP2350 (U4.3), Motor Drivers (H2.4)
Motor 5 PWM: RP2350 (U4.2), Motor Drivers (H3.3)
Motor 6 PWM: RP2350 (U4.1), Motor Drivers (H3.4)
NRF CE: Overview and Power (TP3.1), RP2350 (U4.42), NRF24L01P (U2.1)
NRF CS: Overview and Power (TP2.1), RP2350 (U4.40), NRF24L01P (U2.2)
NRF INT: RP2350 (U4.37), NRF24L01P (U2.6)
NRF MISO: RP2350 (U4.36), NRF24L01P (U2.5)
NRF MOSI: RP2350 (U4.39), NRF24L01P (U2.4)
NRF SCK: RP2350 (U4.38), NRF24L01P (U2.3)
Right Motor Control 1: RP2350 (U4.18), Motor Drivers (H1.5 H1.6 H2.5)
Right Motor Control 2: RP2350 (U4.19), Motor Drivers (H1.7 H1.8 H2.7)
RP2350-USB-5V-VIN: Power (S3.1), RP2350 (X2.A4 X2.A9 X2.B4 X2.B9)
SCL: Overview and Power (TP4.1), RP2350 (R16.1 U4.9), Peripheral Connections (H7.2 H8.2)
SDA: Overview and Power (TP5.1), RP2350 (R15.1 U4.8), Peripheral Connections (H7.1 H8.1)
Servo 1 PWM: RP2350 (U4.11), Motor Drivers (H6.1)
Servo 2 PWM: RP2350 (U4.12), Motor Drivers (H6.2)
Servo 3 PWM: RP2350 (U4.13), Motor Drivers (H6.3)
Servo 4 PWM: RP2350 (U4.14), Motor Drivers (H6.4)
UART0 RX: RP2350 (U4.56), Peripheral Connections (H4.2)
UART0 TX: RP2350 (U4.55), Peripheral Connections (H4.3)
UART1 RX: RP2350 (U4.46), Peripheral Connections (H5.2)
UART1 TX: RP2350 (U4.45), Peripheral Connections (H5.3)
USB4_D_N: USB Hub (R39.1), Peripheral Connections (U10.18)
USB4_D_P: USB Hub (R37.1), Peripheral Connections (U10.19)
USB-Reset: Overview and Power (TP11.1), USB Hub (C67.2 R51.2 U7.4)
USB-VIN: Overview and Power (TP7.1), Power (F2.2 Q1.3)